# Altium schematic sheet INV.Main.SchDoc
size 1200 x 599 mm; SheetNumber: 3; SheetTotal: 3
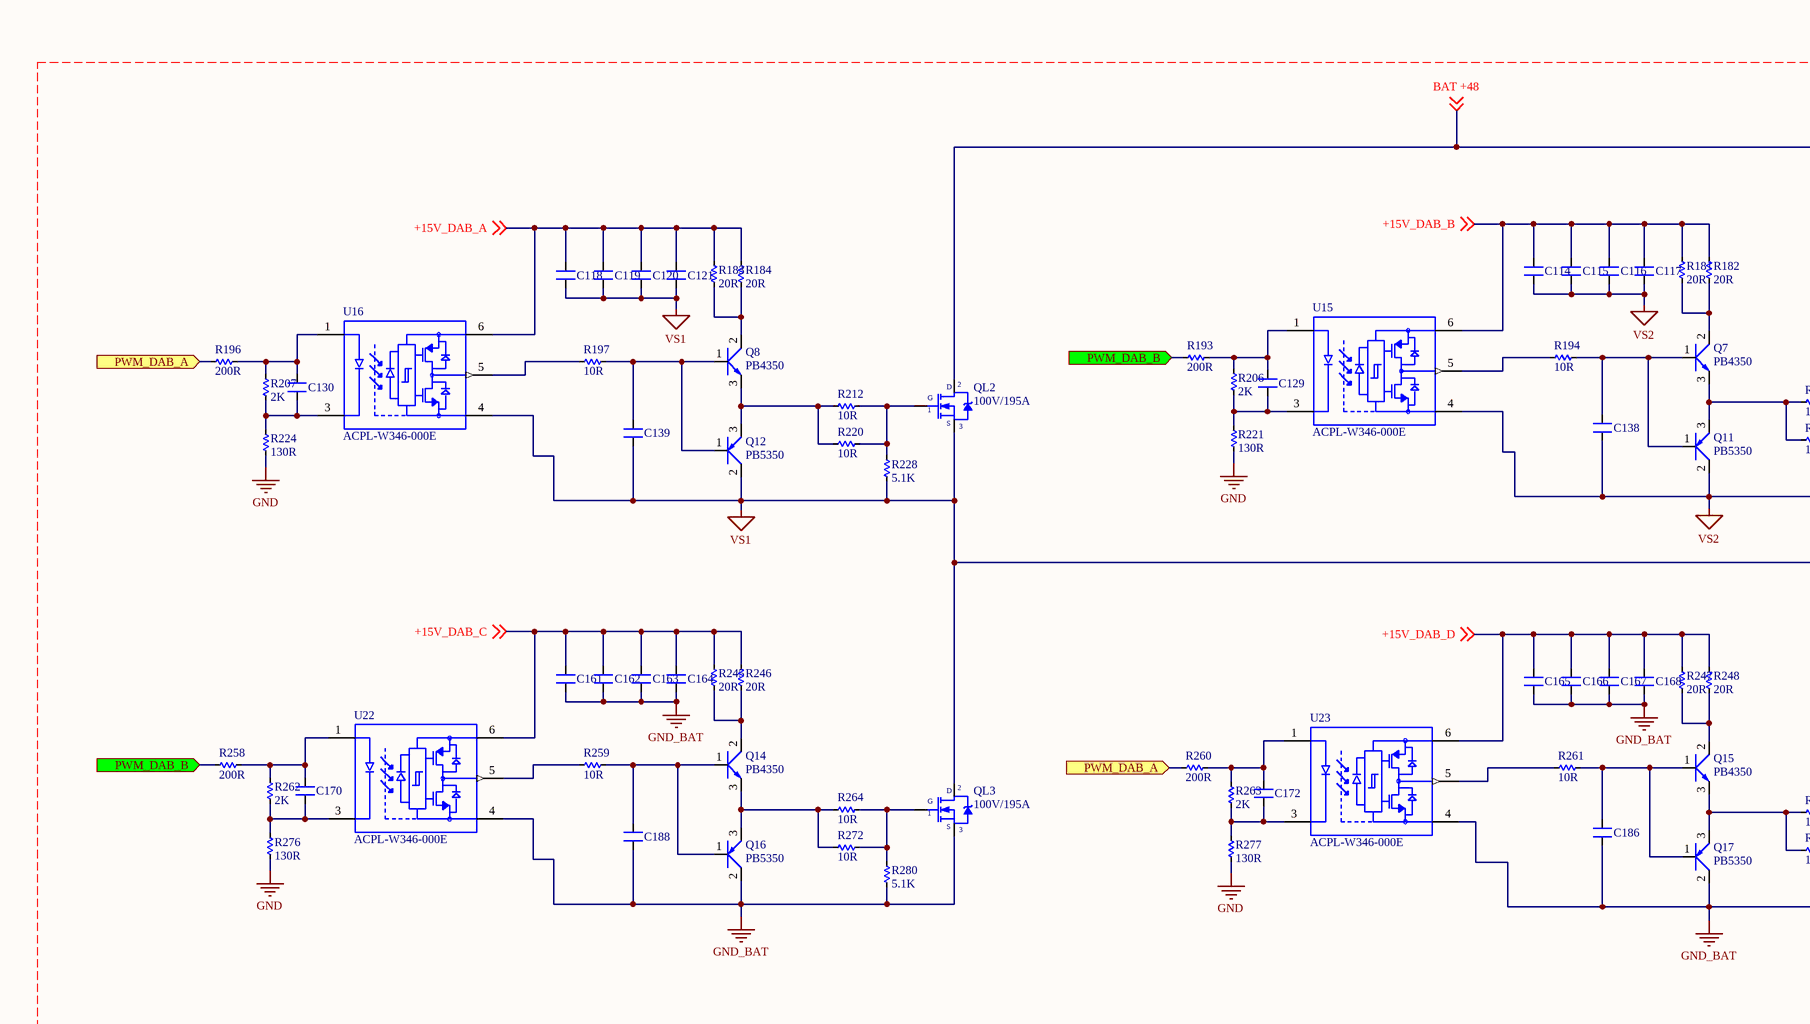
[diagram p0: INV.Main.SchDoc, top left]
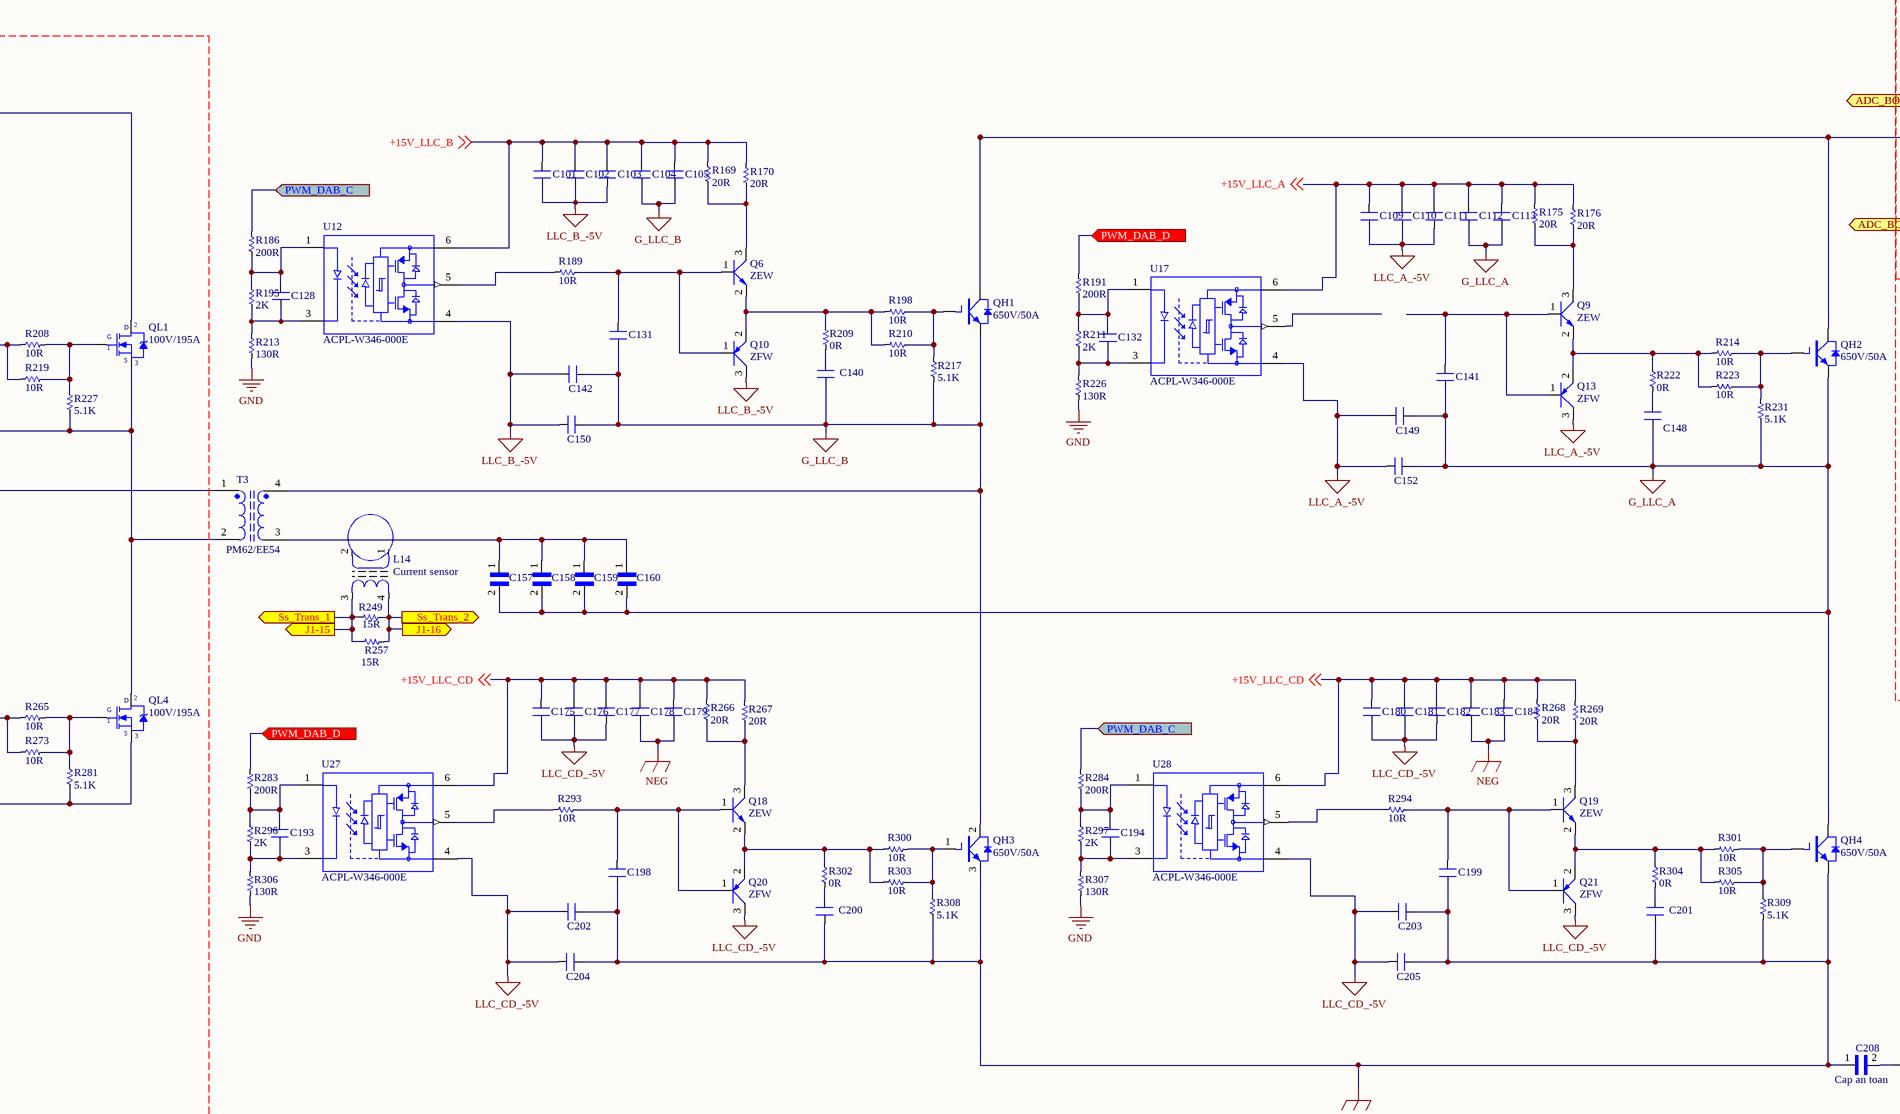
[diagram p1: INV.Main.SchDoc, top middle]
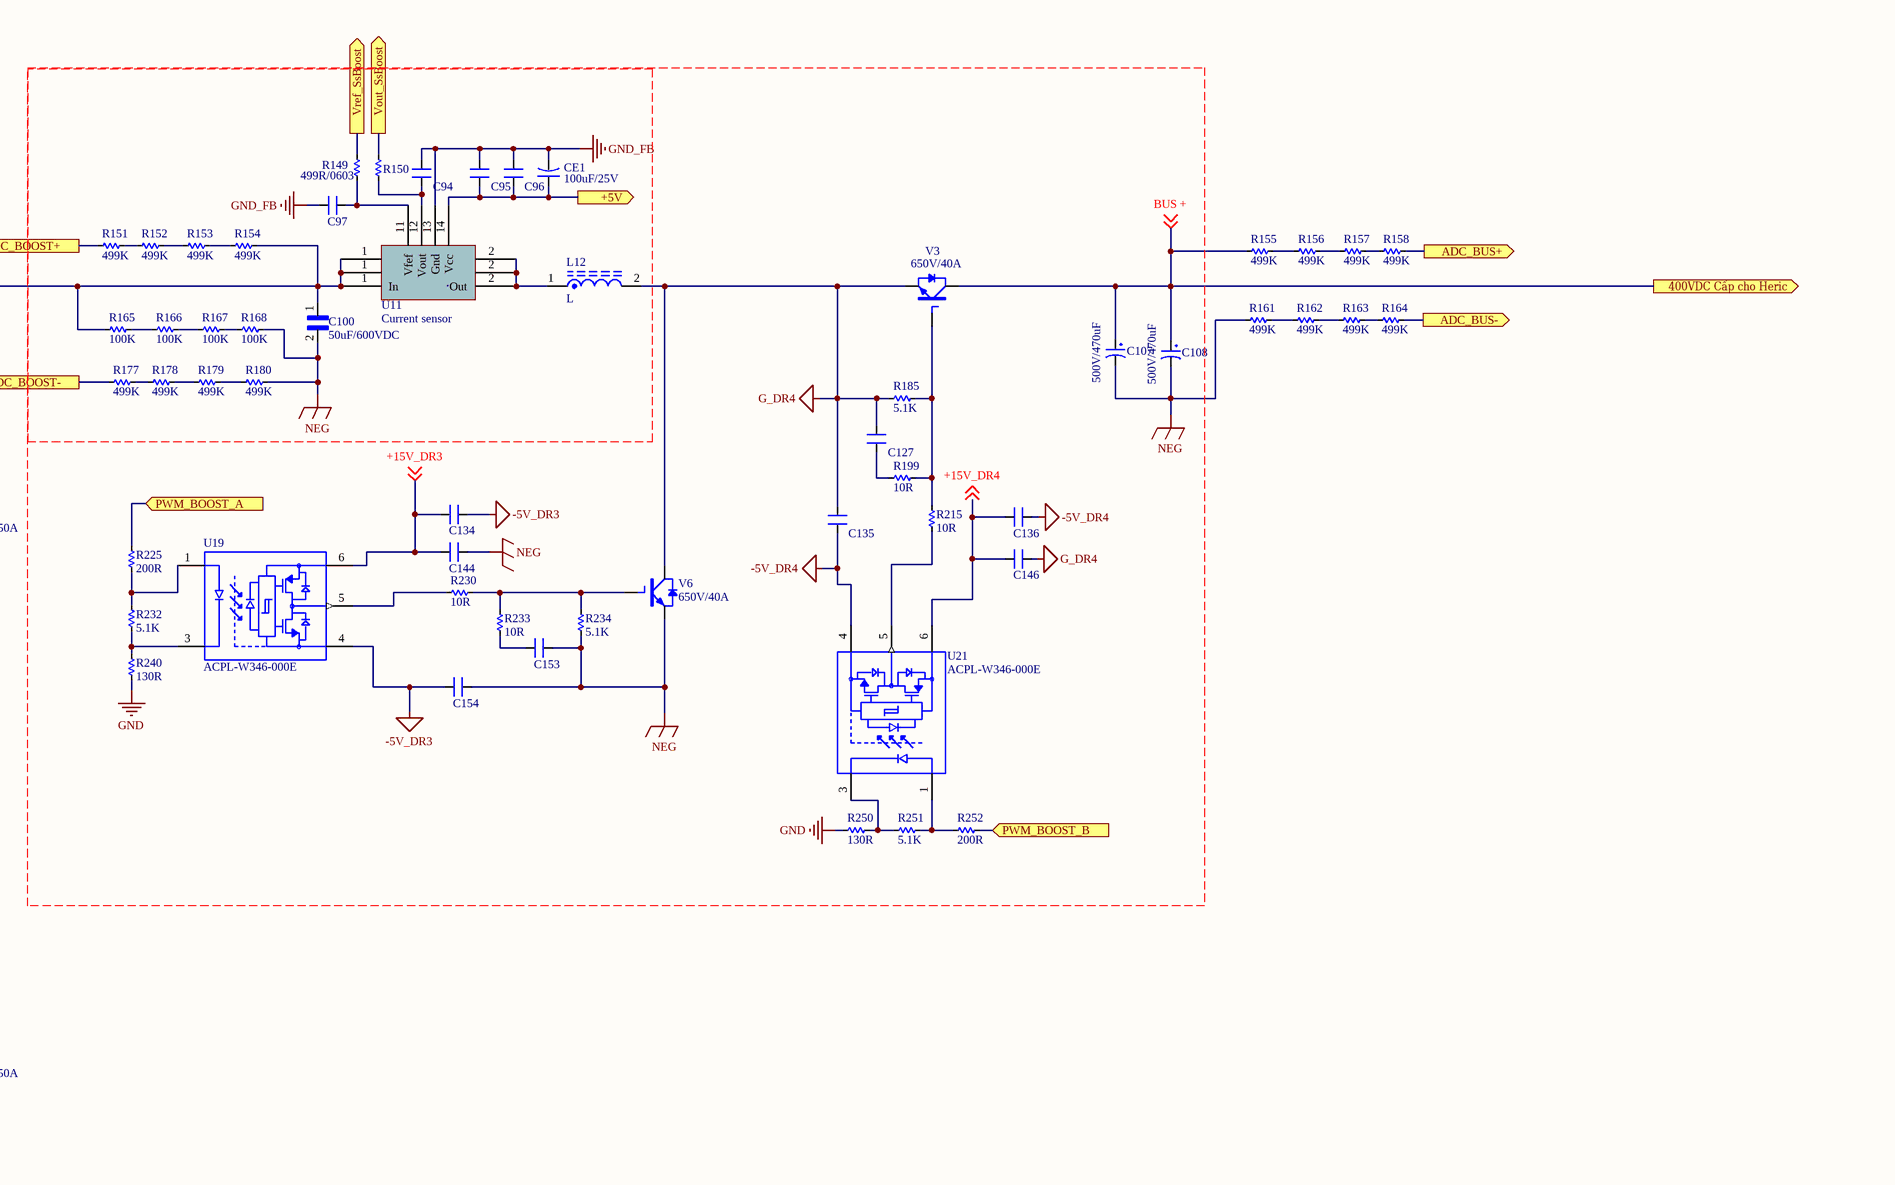
[diagram p2: INV.Main.SchDoc, top right]
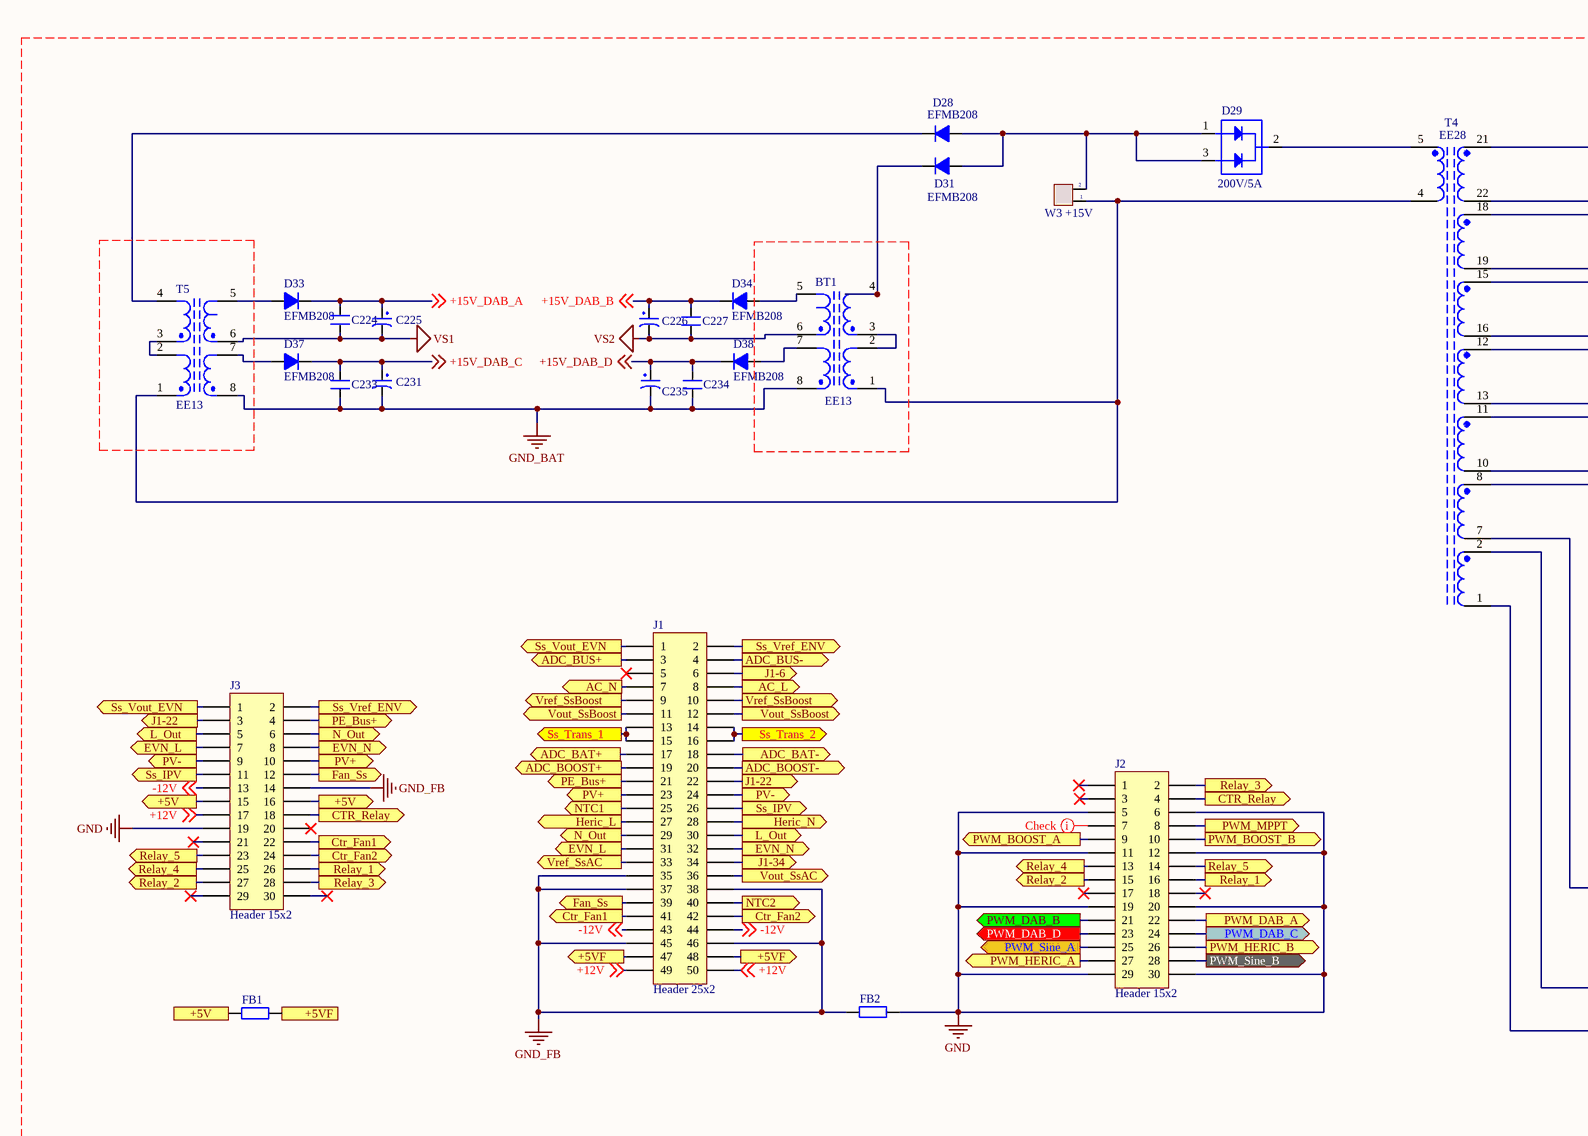
[diagram p3: INV.Main.SchDoc, bottom left]
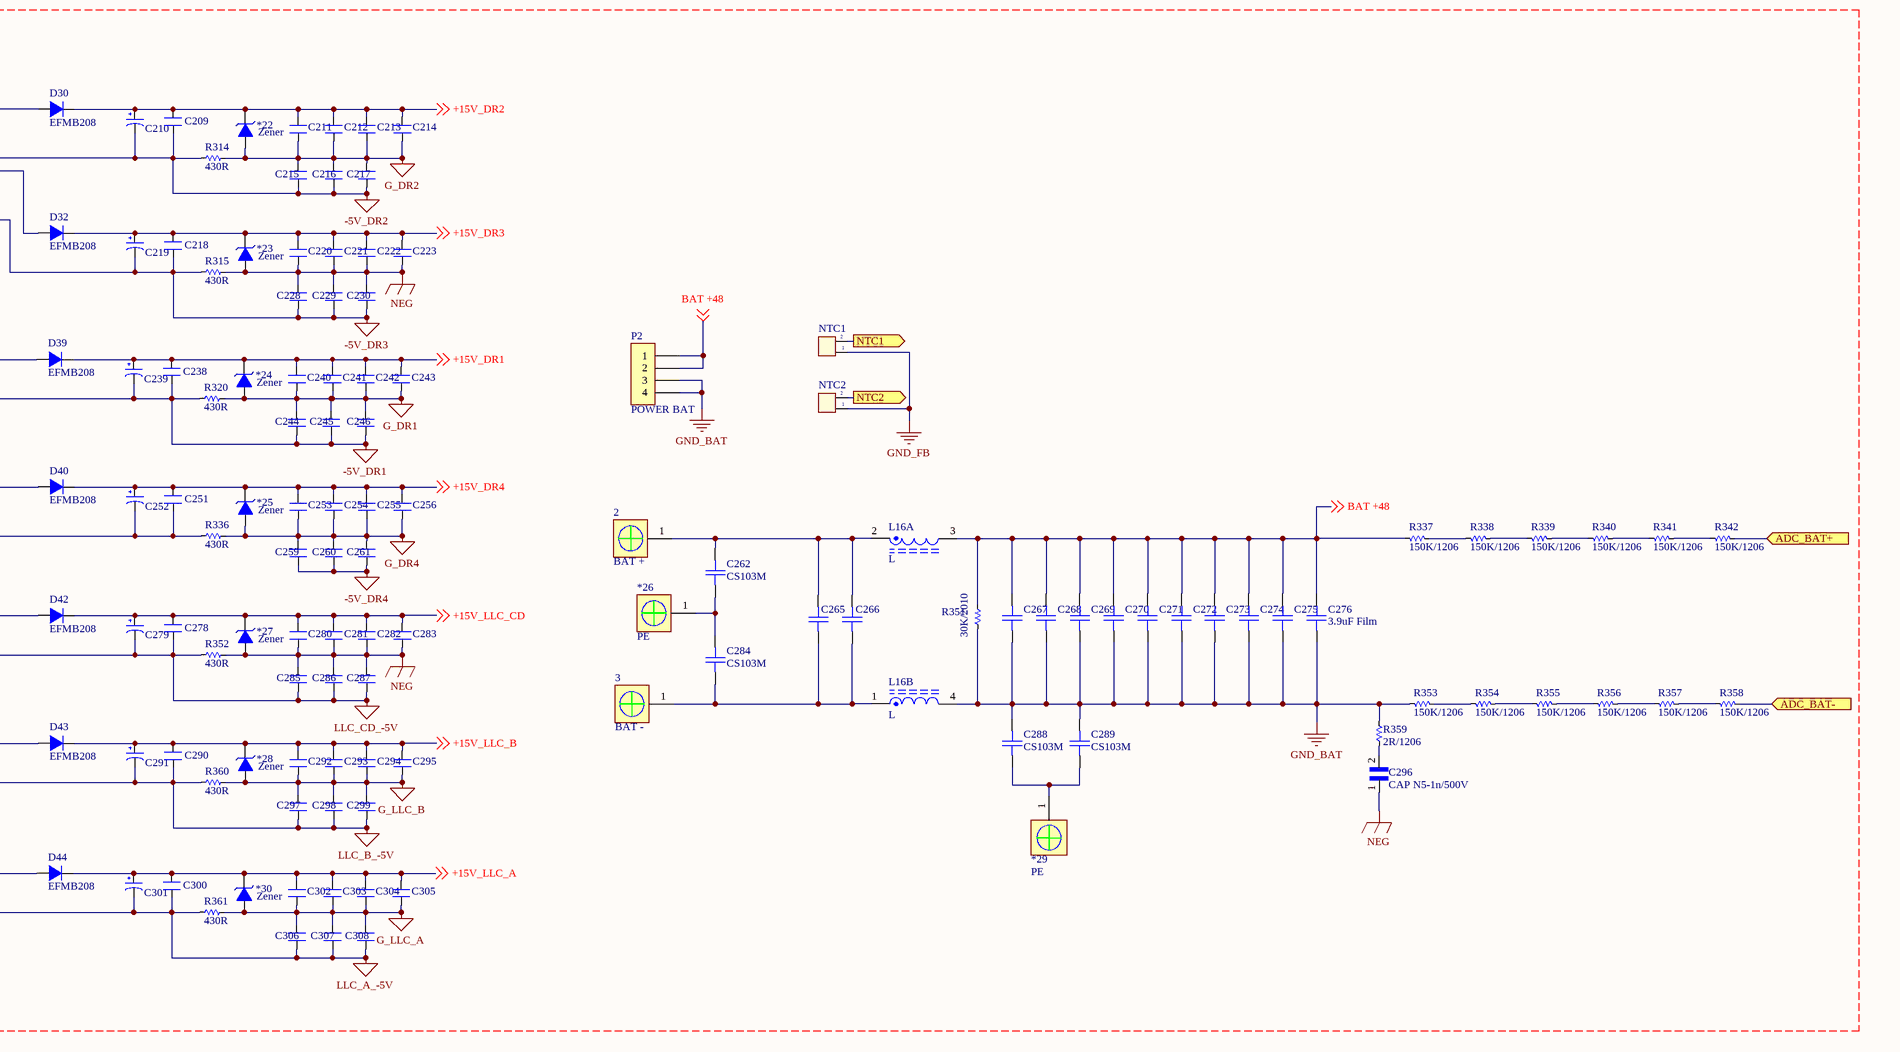
[diagram p4: INV.Main.SchDoc, bottom middle]
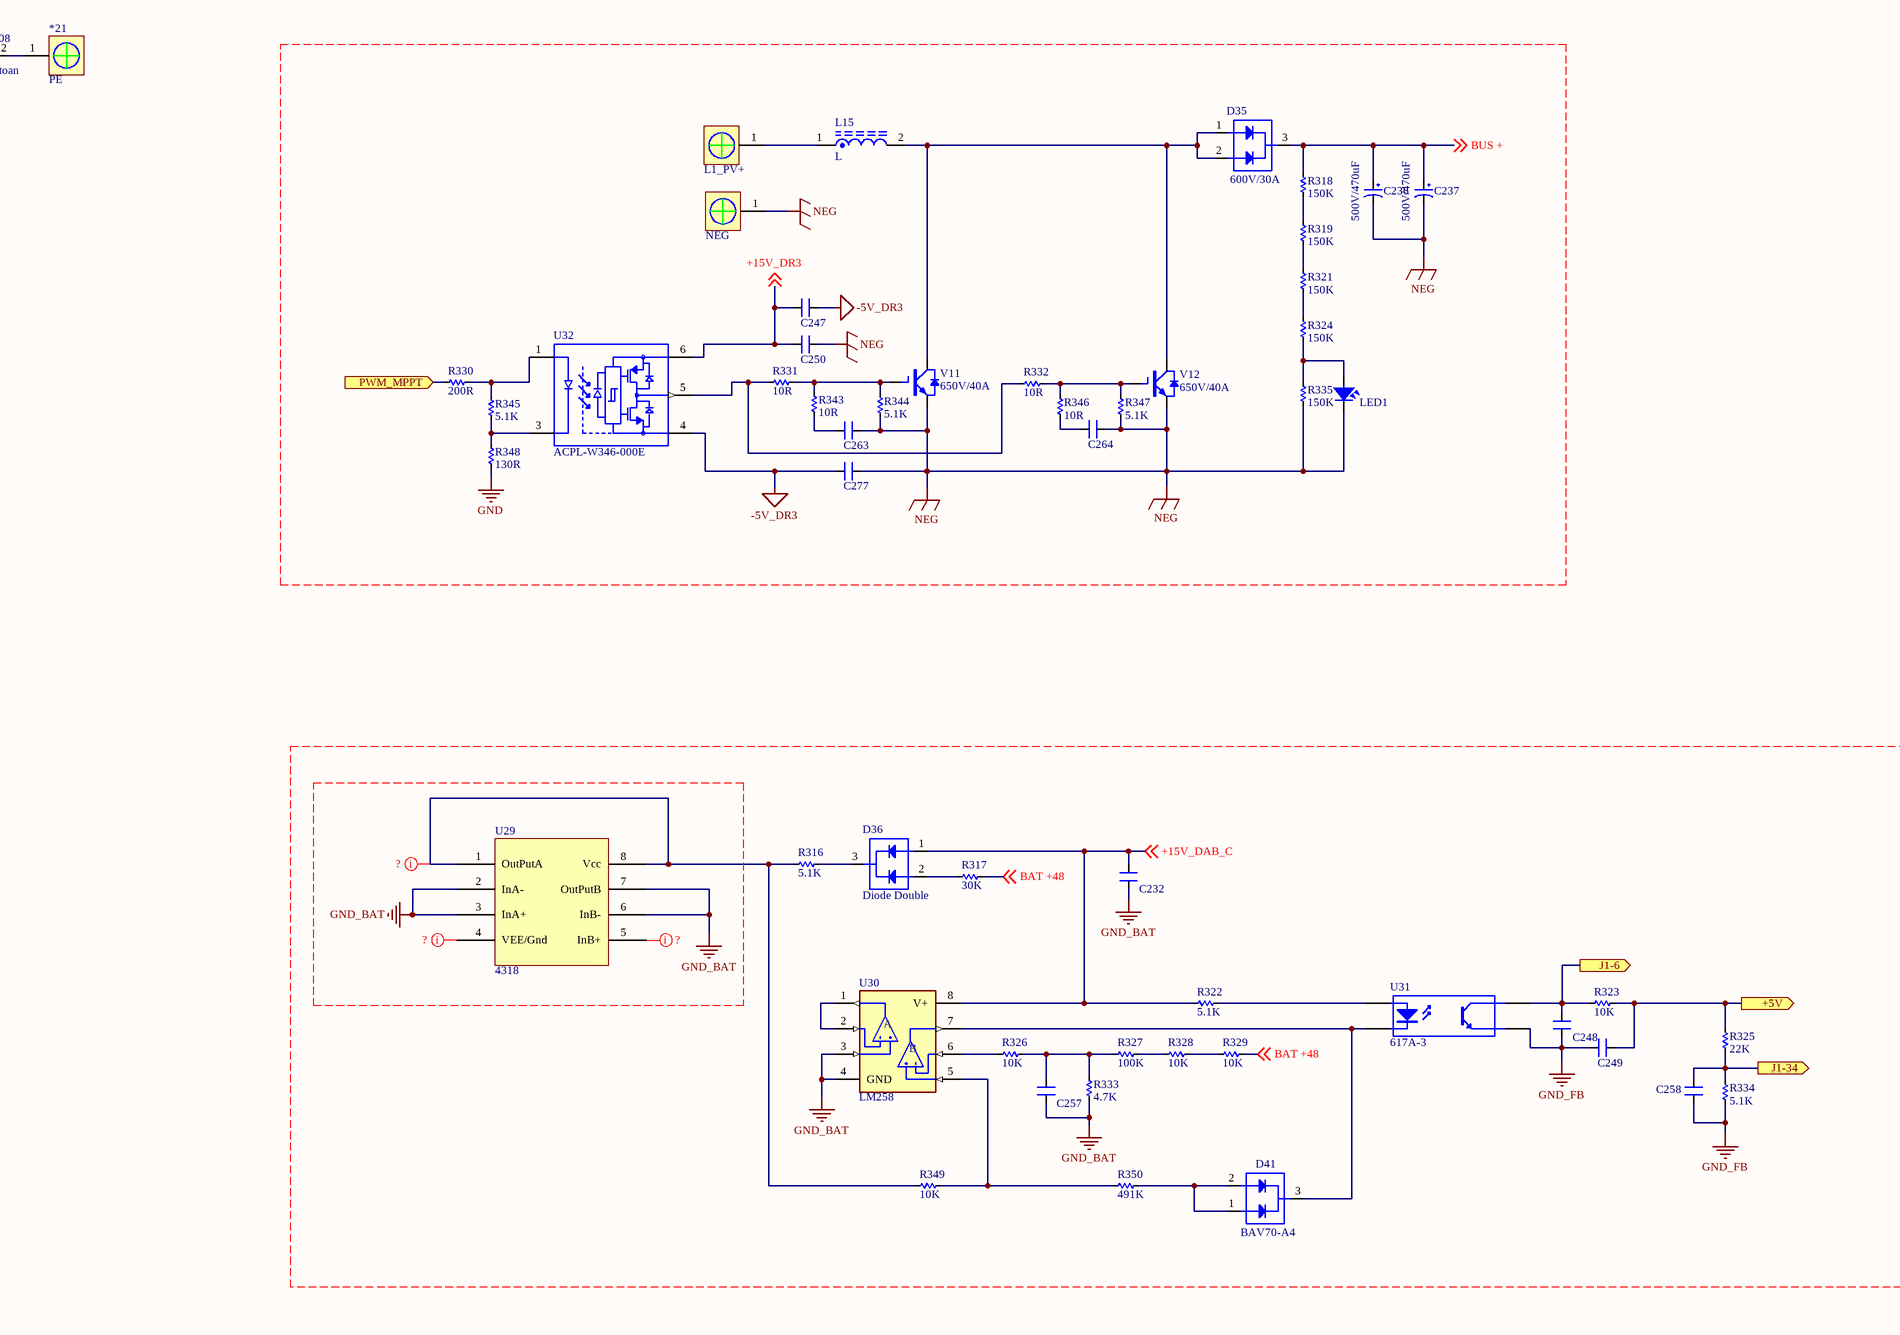
[diagram p5: INV.Main.SchDoc, bottom right]

## Parts
2  BAT +  [Copper Pipe]
3  BAT -  [Copper Pipe]
*21  PE  [Copper Pipe]
*22  Zener  [SMA]
*23  Zener  [SMA]
*24  Zener  [SMA]
*25  Zener  [SMA]
*26  PE  [Copper Pipe]
*27  Zener  [SMA]
*28  Zener  [SMA]
*29  PE  [Copper Pipe]
*30  Zener  [SMA]
BT1  EE13  [Transformer EE13]
C94  0805  [CAP-SMD-0805 EX]  (value not drawn)
C95  0805  [CAP-SMD-0805 EX]  (value not drawn)
C96  0805  [CAP-SMD-0805 EX]  (value not drawn)
C97  0805  [CAP-SMD-0805 EX]  (value not drawn)
C100  50uF/600VDC  [CAP C3D 35x46x35mm]
C101  0805  [CAP-SMD-0805 EX]  (value not drawn)
C102  0805  [CAP-SMD-0805 EX]  (value not drawn)
C103  0805  [CAP-SMD-0805 EX]  (value not drawn)
C104  0805  [CAP-SMD-0805 EX]  (value not drawn)
C105  0805  [CAP-SMD-0805 EX]  (value not drawn)
C107  500V/470uF  [CAP-35x60mm]
C108  500V/470uF  [CAP-35x60mm]
C109  0805  [CAP-SMD-0805 EX]  (value not drawn)
C110  0805  [CAP-SMD-0805 EX]  (value not drawn)
C111  0805  [CAP-SMD-0805 EX]  (value not drawn)
C112  0805  [CAP-SMD-0805 EX]  (value not drawn)
C113  0805  [CAP-SMD-0805 EX]  (value not drawn)
C114  0805  [CAP-SMD-0805 EX]  (value not drawn)
C115  0805  [CAP-SMD-0805 EX]  (value not drawn)
C116  0805  [CAP-SMD-0805 EX]  (value not drawn)
C117  0805  [CAP-SMD-0805 EX]  (value not drawn)
C118  0805  [CAP-SMD-0805 EX]  (value not drawn)
C119  0805  [CAP-SMD-0805 EX]  (value not drawn)
C120  0805  [CAP-SMD-0805 EX]  (value not drawn)
C121  0805  [CAP-SMD-0805 EX]  (value not drawn)
C127  0805  [CAP-SMD-0805 EX]  (value not drawn)
C128  0805  [CAP-SMD-0805 EX]  (value not drawn)
C129  0805  [CAP-SMD-0805 EX]  (value not drawn)
C130  0805  [CAP-SMD-0805 EX]  (value not drawn)
C131  0805  [CAP-SMD-0805 EX]  (value not drawn)
C132  0805  [CAP-SMD-0805 EX]  (value not drawn)
C134  0805  [CAP-SMD-0805 EX]  (value not drawn)
C135  0805  [CAP-SMD-0805 EX]  (value not drawn)
C136  0805  [CAP-SMD-0805 EX]  (value not drawn)
C138  0805  [CAP-SMD-0805 EX]  (value not drawn)
C139  0805  [CAP-SMD-0805 EX]  (value not drawn)
C140  Tu dan gom  [CAP-SMD-0805 EX]  (value not drawn)
C141  0805  [CAP-SMD-0805 EX]  (value not drawn)
C142  0805  [CAP-SMD-0805 EX]  (value not drawn)
C144  0805  [CAP-SMD-0805 EX]  (value not drawn)
C146  0805  [CAP-SMD-0805 EX]  (value not drawn)
C148  0805  [CAP-SMD-0805 EX]  (value not drawn)
C149  0805  [CAP-SMD-0805 EX]  (value not drawn)
C150  0805  [CAP-SMD-0805 EX]  (value not drawn)
C152  0805  [CAP-SMD-0805 EX]  (value not drawn)
C153  0805  [CAP-SMD-0805 EX]  (value not drawn)
C154  0805  [CAP-SMD-0805 EX]  (value not drawn)
C157  CBB 150nF/630V  [CAP MMPK82]  (value not drawn)
C158  CBB 150nF/630V  [CAP MMPK82]  (value not drawn)
C159  CBB 150nF/630V  [CAP MMPK82]  (value not drawn)
C160  CBB 150nF/630V  [CAP MMPK82]  (value not drawn)
C161  0805  [CAP-SMD-0805 EX]  (value not drawn)
C162  0805  [CAP-SMD-0805 EX]  (value not drawn)
C163  0805  [CAP-SMD-0805 EX]  (value not drawn)
C164  0805  [CAP-SMD-0805 EX]  (value not drawn)
C165  0805  [CAP-SMD-0805 EX]  (value not drawn)
C166  0805  [CAP-SMD-0805 EX]  (value not drawn)
C167  0805  [CAP-SMD-0805 EX]  (value not drawn)
C168  0805  [CAP-SMD-0805 EX]  (value not drawn)
C170  0805  [CAP-SMD-0805 EX]  (value not drawn)
C172  0805  [CAP-SMD-0805 EX]  (value not drawn)
C175  0805  [CAP-SMD-0805 EX]  (value not drawn)
C176  0805  [CAP-SMD-0805 EX]  (value not drawn)
C177  0805  [CAP-SMD-0805 EX]  (value not drawn)
C178  0805  [CAP-SMD-0805 EX]  (value not drawn)
C179  0805  [CAP-SMD-0805 EX]  (value not drawn)
C180  0805  [CAP-SMD-0805 EX]  (value not drawn)
C181  0805  [CAP-SMD-0805 EX]  (value not drawn)
C182  0805  [CAP-SMD-0805 EX]  (value not drawn)
C183  0805  [CAP-SMD-0805 EX]  (value not drawn)
C184  0805  [CAP-SMD-0805 EX]  (value not drawn)
C186  0805  [CAP-SMD-0805 EX]  (value not drawn)
C188  0805  [CAP-SMD-0805 EX]  (value not drawn)
C193  0805  [CAP-SMD-0805 EX]  (value not drawn)
C194  0805  [CAP-SMD-0805 EX]  (value not drawn)
C198  0805  [CAP-SMD-0805 EX]  (value not drawn)
C199  0805  [CAP-SMD-0805 EX]  (value not drawn)
C200  Tu dan gom  [CAP-SMD-0805 EX]  (value not drawn)
C201  Tu dan gom  [CAP-SMD-0805 EX]  (value not drawn)
C202  0805  [CAP-SMD-0805 EX]  (value not drawn)
C203  0805  [CAP-SMD-0805 EX]  (value not drawn)
C204  0805  [CAP-SMD-0805 EX]  (value not drawn)
C205  0805  [CAP-SMD-0805 EX]  (value not drawn)
C208  Cap an toan  [Cap an toan]
C209  Tu dan gom  [CAP-SMD-0805 EX]  (value not drawn)
C210  100uF/25V  [CA-6-P2.5]  (value not drawn)
C211  Tu dan gom  [CAP-SMD-0805 EX]  (value not drawn)
C212  Tu dan gom  [CAP-SMD-0805 EX]  (value not drawn)
C213  Tu dan gom  [CAP-SMD-0805 EX]  (value not drawn)
C214  Tu dan gom  [CAP-SMD-0805 EX]  (value not drawn)
C215  Tu dan gom  [CAP-SMD-0805 EX]  (value not drawn)
C216  Tu dan gom  [CAP-SMD-0805 EX]  (value not drawn)
C217  Tu dan gom  [CAP-SMD-0805 EX]  (value not drawn)
C218  Tu dan gom  [CAP-SMD-0805 EX]  (value not drawn)
C219  100uF/25V  [CA-6-P2.5]  (value not drawn)
C220  Tu dan gom  [CAP-SMD-0805 EX]  (value not drawn)
C221  Tu dan gom  [CAP-SMD-0805 EX]  (value not drawn)
C222  Tu dan gom  [CAP-SMD-0805 EX]  (value not drawn)
C223  Tu dan gom  [CAP-SMD-0805 EX]  (value not drawn)
C224  0805  [CAP-SMD-0805 EX]  (value not drawn)
C225  100uF/25V  [CA-6-P2.5]  (value not drawn)
C226  100uF/25V  [CA-6-P2.5]  (value not drawn)
C227  0805  [CAP-SMD-0805 EX]  (value not drawn)
C228  Tu dan gom  [CAP-SMD-0805 EX]  (value not drawn)
C229  Tu dan gom  [CAP-SMD-0805 EX]  (value not drawn)
C230  Tu dan gom  [CAP-SMD-0805 EX]  (value not drawn)
C231  100uF/25V  [CA-6-P2.5]  (value not drawn)
C232  0805  [CAP-SMD-0805 EX]  (value not drawn)
C233  0805  [CAP-SMD-0805 EX]  (value not drawn)
C234  0805  [CAP-SMD-0805 EX]  (value not drawn)
C235  100uF/25V  [CA-6-P2.5]  (value not drawn)
C236  500V/470uF  [CAP-10X17-N]
C237  500V/470uF  [CAP-10X17-N]
C238  Tu dan gom  [CAP-SMD-0805 EX]  (value not drawn)
C239  100uF/25V  [CA-6-P2.5]  (value not drawn)
C240  Tu dan gom  [CAP-SMD-0805 EX]  (value not drawn)
C241  Tu dan gom  [CAP-SMD-0805 EX]  (value not drawn)
C242  Tu dan gom  [CAP-SMD-0805 EX]  (value not drawn)
C243  Tu dan gom  [CAP-SMD-0805 EX]  (value not drawn)
C244  Tu dan gom  [CAP-SMD-0805 EX]  (value not drawn)
C245  Tu dan gom  [CAP-SMD-0805 EX]  (value not drawn)
C246  Tu dan gom  [CAP-SMD-0805 EX]  (value not drawn)
C247  0805  [CAP-SMD-0805 EX]  (value not drawn)
C248  0805  [CAP-SMD-0805 EX]  (value not drawn)
C249  0805  [CAP-SMD-0805 EX]  (value not drawn)
C250  0805  [CAP-SMD-0805 EX]  (value not drawn)
C251  Tu dan gom  [CAP-SMD-0805 EX]  (value not drawn)
C252  100uF/25V  [CA-6-P2.5]  (value not drawn)
C253  Tu dan gom  [CAP-SMD-0805 EX]  (value not drawn)
C254  Tu dan gom  [CAP-SMD-0805 EX]  (value not drawn)
C255  Tu dan gom  [CAP-SMD-0805 EX]  (value not drawn)
C256  Tu dan gom  [CAP-SMD-0805 EX]  (value not drawn)
C257  0805  [CAP-SMD-0805 EX]  (value not drawn)
C258  0805  [CAP-SMD-0805 EX]  (value not drawn)
C259  Tu dan gom  [CAP-SMD-0805 EX]  (value not drawn)
C260  Tu dan gom  [CAP-SMD-0805 EX]  (value not drawn)
C261  Tu dan gom  [CAP-SMD-0805 EX]  (value not drawn)
C262  CS103M  [Cap an toan CS103M]
C263  0805  [CAP-SMD-0805 EX]  (value not drawn)
C264  0805  [CAP-SMD-0805 EX]  (value not drawn)
C265  (no value)  [CAP-SMD-1206 EX]
C266  (no value)  [CAP-SMD-1206 EX]
C267  3.9uF Film  [Cap Film CL21]  (value not drawn)
C268  395K  [Cap Film CL21]  (value not drawn)
C269  395K  [Cap Film CL21]  (value not drawn)
C270  395K  [Cap Film CL21]  (value not drawn)
C271  395K  [Cap Film CL21]  (value not drawn)
C272  395K  [Cap Film CL21]  (value not drawn)
C273  395K  [Cap Film CL21]  (value not drawn)
C274  395K  [Cap Film CL21]  (value not drawn)
C275  395K  [Cap Film CL21]  (value not drawn)
C276  3.9uF Film  [Cap Film CL21]
C277  0805  [CAP-SMD-0805 EX]  (value not drawn)
C278  Tu dan gom  [CAP-SMD-0805 EX]  (value not drawn)
C279  100uF/25V  [CA-6-P2.5]  (value not drawn)
C280  Tu dan gom  [CAP-SMD-0805 EX]  (value not drawn)
C281  Tu dan gom  [CAP-SMD-0805 EX]  (value not drawn)
C282  Tu dan gom  [CAP-SMD-0805 EX]  (value not drawn)
C283  Tu dan gom  [CAP-SMD-0805 EX]  (value not drawn)
C284  CS103M  [Cap an toan CS103M]
C285  Tu dan gom  [CAP-SMD-0805 EX]  (value not drawn)
C286  Tu dan gom  [CAP-SMD-0805 EX]  (value not drawn)
C287  Tu dan gom  [CAP-SMD-0805 EX]  (value not drawn)
C288  CS103M  [Cap an toan CS103M]
C289  CS103M  [Cap an toan CS103M]
C290  Tu dan gom  [CAP-SMD-0805 EX]  (value not drawn)
C291  100uF/25V  [CA-6-P2.5]  (value not drawn)
C292  Tu dan gom  [CAP-SMD-0805 EX]  (value not drawn)
C293  Tu dan gom  [CAP-SMD-0805 EX]  (value not drawn)
C294  Tu dan gom  [CAP-SMD-0805 EX]  (value not drawn)
C295  Tu dan gom  [CAP-SMD-0805 EX]  (value not drawn)
C296  CAP N5-1n/500V  [CAP 1nF/500VAC, Y1]
C297  Tu dan gom  [CAP-SMD-0805 EX]  (value not drawn)
C298  Tu dan gom  [CAP-SMD-0805 EX]  (value not drawn)
C299  Tu dan gom  [CAP-SMD-0805 EX]  (value not drawn)
C300  Tu dan gom  [CAP-SMD-0805 EX]  (value not drawn)
C301  100uF/25V  [CA-6-P2.5]  (value not drawn)
C302  Tu dan gom  [CAP-SMD-0805 EX]  (value not drawn)
C303  Tu dan gom  [CAP-SMD-0805 EX]  (value not drawn)
C304  Tu dan gom  [CAP-SMD-0805 EX]  (value not drawn)
C305  Tu dan gom  [CAP-SMD-0805 EX]  (value not drawn)
C306  Tu dan gom  [CAP-SMD-0805 EX]  (value not drawn)
C307  Tu dan gom  [CAP-SMD-0805 EX]  (value not drawn)
C308  Tu dan gom  [CAP-SMD-0805 EX]  (value not drawn)
CE1  100uF/25V  [CA-6-P2.5]
D28  EFMB208  [SMB]
D29  200V/5A  [TO252-123]
D30  EFMB208  [SMB]
D31  EFMB208  [SMB]
D32  EFMB208  [SMB]
D33  EFMB208  [SMB]
D34  EFMB208  [SMB]
D35  600V/30A  [TO-247-Diode]
D36  Diode Double  [SOT-23]
D37  EFMB208  [SMB]
D38  EFMB208  [SMB]
D39  EFMB208  [SMB]
D40  EFMB208  [SMB]
D41  BAV70-A4  [SOT-23]
D42  EFMB208  [SMB]
D43  EFMB208  [SMB]
D44  EFMB208  [SMB]
FB1  (no value)  [RES-SMD-1206 EX]
FB2  (no value)  [RES-SMD-1206 EX]
J1  Header 25x2  [Header 2x50]
J2  Header 15x2  [Header 2x15]
J3  Header 15x2  [Head 1X16 - CAI THANG]
J6  W3 +15V  [Header2]
L12  L  [LBOSHOG-V1]
L14  Current sensor  [Bien ap do Current]
L15  L  [LBOSPVOG-V1]
L16  L  [LBATOG-V1]  (parts A,B of 2)
LED1  LED  [LED-0805-Red]  (value not drawn)
NTC1  Temp Sensor  [JP 1x2 CT]  (value not drawn)
NTC2  Temp Sensor  [JP 1x2 CT]  (value not drawn)
P2  POWER BAT  [XH2.54M-4]
PV_+3  L1_PV+  [Copper Pipe]
PV_+4  NEG  [Copper Pipe]
Q6  ZEW  [SOT-23]
Q7  PB4350  [SOT223]
Q8  PB4350  [SOT223]
Q9  ZEW  [SOT-23]
Q10  ZFW  [SOT-23]
Q11  PB5350  [SOT223]
Q12  PB5350  [SOT223]
Q13  ZFW  [SOT-23]
Q14  PB4350  [SOT223]
Q15  PB4350  [SOT223]
Q16  PB5350  [SOT223]
Q17  PB5350  [SOT223]
Q18  ZEW  [SOT-23]
Q19  ZEW  [SOT-23]
Q20  ZFW  [SOT-23]
Q21  ZFW  [SOT-23]
QH1  650V/50A  [TO-247_1]
QH2  650V/50A  [TO-247_1]
QH3  650V/50A  [TO-247_1]
QH4  650V/50A  [TO-247_1]
QL1  100V/195A  [TO-247]
QL2  100V/195A  [TO-247]
QL3  100V/195A  [TO-247]
QL4  100V/195A  [TO-247]
R149  499R/0603  [RES-SMD-1206 EX]
R150  499R/0603  [RES-SMD-1206 EX]  (value not drawn)
R151  499K  [RES-SMD-1206 EX]
R152  499K  [RES-SMD-1206 EX]
R153  499K  [RES-SMD-1206 EX]
R154  499K  [RES-SMD-1206 EX]
R155  499K  [RES-SMD-1206 EX]
R156  499K  [RES-SMD-1206 EX]
R157  499K  [RES-SMD-1206 EX]
R158  499K  [RES-SMD-1206 EX]
R161  499K  [RES-SMD-1206 EX]
R162  499K  [RES-SMD-1206 EX]
R163  499K  [RES-SMD-1206 EX]
R164  499K  [RES-SMD-1206 EX]
R165  100K  [RES-SMD-1206 EX]
R166  100K  [RES-SMD-1206 EX]
R167  100K  [RES-SMD-1206 EX]
R168  100K  [RES-SMD-1206 EX]
R169  20R  [RES-SMD-0805 EX]
R170  20R  [RES-SMD-0805 EX]
R175  20R  [RES-SMD-0805 EX]
R176  20R  [RES-SMD-0805 EX]
R177  499K  [RES-SMD-1206 EX]
R178  499K  [RES-SMD-1206 EX]
R179  499K  [RES-SMD-1206 EX]
R180  499K  [RES-SMD-1206 EX]
R181  20R  [RES-SMD-0805 EX]
R182  20R  [RES-SMD-0805 EX]
R183  20R  [RES-SMD-0805 EX]
R184  20R  [RES-SMD-0805 EX]
R185  5.1K  [RES-SMD-0805 EX]
R186  200R  [RES-SMD-0805 EX]
R189  10R  [RES-SMD-0805 EX]
R191  200R  [RES-SMD-0805 EX]
R193  200R  [RES-SMD-0805 EX]
R194  10R  [RES-SMD-0805 EX]
R195  2K  [RES-SMD-0805 EX]
R196  200R  [RES-SMD-0805 EX]
R197  10R  [RES-SMD-0805 EX]
R198  10R  [RES-SMD-0805 EX]
R199  10R  [RES-SMD-0805 EX]
R206  2K  [RES-SMD-0805 EX]
R207  2K  [RES-SMD-0805 EX]
R208  10R  [RES-SMD-0805 EX]
R209  0R  [RES-SMD-0805 EX]
R210  10R  [RES-SMD-0805 EX]
R211  2K  [RES-SMD-0805 EX]
R212  10R  [RES-SMD-0805 EX]
R213  130R  [RES-SMD-0805 EX]
R214  10R  [RES-SMD-0805 EX]
R215  10R  [RES-SMD-0805 EX]
R217  5.1K  [RES-SMD-0805 EX]
R219  10R  [RES-SMD-0805 EX]
R220  10R  [RES-SMD-0805 EX]
R221  130R  [RES-SMD-0805 EX]
R222  0R  [RES-SMD-0805 EX]
R223  10R  [RES-SMD-0805 EX]
R224  130R  [RES-SMD-0805 EX]
R225  200R  [RES-SMD-0805 EX]
R226  130R  [RES-SMD-0805 EX]
R227  5.1K  [RES-SMD-0805 EX]
R228  5.1K  [RES-SMD-0805 EX]
R230  10R  [RES-SMD-0805 EX]
R231  5.1K  [RES-SMD-0805 EX]
R232  5.1K  [RES-SMD-0805 EX]
R233  10R  [RES-SMD-0805 EX]
R234  5.1K  [RES-SMD-0805 EX]
R240  130R  [RES-SMD-0805 EX]
R245  20R  [RES-SMD-0805 EX]
R246  20R  [RES-SMD-0805 EX]
R247  20R  [RES-SMD-0805 EX]
R248  20R  [RES-SMD-0805 EX]
R249  15R  [R1206]
R250  130R  [RES-SMD-0805 EX]
R251  5.1K  [RES-SMD-0805 EX]
R252  200R  [RES-SMD-0805 EX]
R257  15R  [R1206]
R258  200R  [RES-SMD-0805 EX]
R259  10R  [RES-SMD-0805 EX]
R260  200R  [RES-SMD-0805 EX]
R261  10R  [RES-SMD-0805 EX]
R262  2K  [RES-SMD-0805 EX]
R263  2K  [RES-SMD-0805 EX]
R264  10R  [RES-SMD-0805 EX]
R265  10R  [RES-SMD-0805 EX]
R266  20R  [RES-SMD-0805 EX]
R267  20R  [RES-SMD-0805 EX]
R268  20R  [RES-SMD-0805 EX]
R269  20R  [RES-SMD-0805 EX]
R272  10R  [RES-SMD-0805 EX]
R273  10R  [RES-SMD-0805 EX]
R276  130R  [RES-SMD-0805 EX]
R277  130R  [RES-SMD-0805 EX]
R280  5.1K  [RES-SMD-0805 EX]
R281  5.1K  [RES-SMD-0805 EX]
R283  200R  [RES-SMD-0805 EX]
R284  200R  [RES-SMD-0805 EX]
R293  10R  [RES-SMD-0805 EX]
R294  10R  [RES-SMD-0805 EX]
R296  2K  [RES-SMD-0805 EX]
R297  2K  [RES-SMD-0805 EX]
R300  10R  [RES-SMD-0805 EX]
R301  10R  [RES-SMD-0805 EX]
R302  0R  [RES-SMD-0805 EX]
R303  10R  [RES-SMD-0805 EX]
R304  0R  [RES-SMD-0805 EX]
R305  10R  [RES-SMD-0805 EX]
R306  130R  [RES-SMD-0805 EX]
R307  130R  [RES-SMD-0805 EX]
R308  5.1K  [RES-SMD-0805 EX]
R309  5.1K  [RES-SMD-0805 EX]
R314  430R  [R1206]
R315  430R  [R1206]
R316  5.1K  [RES-SMD-0805 EX]
R317  30K  [RES-SMD-1210 EX]
R318  150K  [RES-SMD-1210 EX]
R319  150K  [RES-SMD-1210 EX]
R320  430R  [R1206]
R321  150K  [RES-SMD-1210 EX]
R322  5.1K  [RES-SMD-0805 EX]
R323  10K  [RES-SMD-0805 EX]
R324  150K  [RES-SMD-1210 EX]
R325  22K  [RES-SMD-0805 EX]
R326  10K  [RES-SMD-0805 EX]
R327  100K  [RES-SMD-1206 EX]
R328  10K  [RES-SMD-0805 EX]
R329  10K  [RES-SMD-0805 EX]
R330  200R  [RES-SMD-0805 EX]
R331  10R  [RES-SMD-0805 EX]
R332  10R  [RES-SMD-0805 EX]
R333  4.7K  [RES-SMD-0805 EX]
R334  5.1K  [RES-SMD-0805 EX]
R335  150K  [RES-SMD-1210 EX]
R336  430R  [R1206]
R337  150K/1206  [RES-SMD-1206 EX]
R338  150K/1206  [RES-SMD-1206 EX]
R339  150K/1206  [RES-SMD-1206 EX]
R340  150K/1206  [RES-SMD-1206 EX]
R341  150K/1206  [RES-SMD-1206 EX]
R342  150K/1206  [RES-SMD-1206 EX]
R343  10R  [RES-SMD-0805 EX]
R344  5.1K  [RES-SMD-0805 EX]
R345  5.1K  [RES-SMD-0805 EX]
R346  10R  [RES-SMD-0805 EX]
R347  5.1K  [RES-SMD-0805 EX]
R348  130R  [RES-SMD-0805 EX]
R349  10K  [RES-SMD-0805 EX]
R350  491K  [RES-SMD-0805 EX]
R351  30K/2010  [RES-SMD-1210 EX]
R352  430R  [R1206]
R353  150K/1206  [RES-SMD-1206 EX]
R354  150K/1206  [RES-SMD-1206 EX]
R355  150K/1206  [RES-SMD-1206 EX]
R356  150K/1206  [RES-SMD-1206 EX]
R357  150K/1206  [RES-SMD-1206 EX]
R358  150K/1206  [RES-SMD-1206 EX]
R359  2R/1206  [RES-SMD-1206 EX]
R360  430R  [R1206]
R361  430R  [R1206]
T3  PM62/EE54  [Transfomer 600W]
T4  EE28  [Transformer EE28]
T5  EE13  [BAX_DVD3]
U11  Current sensor  [Current sensor STB-CAS]
U12  ACPL-W346-000E  [SOIC127P1150X360-6N]
U15  ACPL-W346-000E  [SOIC127P1150X360-6N]
U16  ACPL-W346-000E  [SOIC127P1150X360-6N]
U17  ACPL-W346-000E  [SOIC127P1150X360-6N]
U19  ACPL-W346-000E  [SOIC127P1150X360-6N]
U21  ACPL-W346-000E  [SOIC127P1150X360-6N]
U22  ACPL-W346-000E  [SOIC127P1150X360-6N]
U23  ACPL-W346-000E  [SOIC127P1150X360-6N]
U27  ACPL-W346-000E  [SOIC127P1150X360-6N]
U28  ACPL-W346-000E  [SOIC127P1150X360-6N]
U29  4318  [SOP 8]
U30  LM258  [SOIC127P600X175-8N]
U31  617A-3  [OPTO TRANSISTOR_SOP-4]
U32  ACPL-W346-000E  [SOIC127P1150X360-6N]
V3  650V/40A  [TO-247_1]
V6  650V/40A  [TO-247_1]
V11  650V/40A  [TO-3P]
V12  650V/40A  [TO-247_1]

## Ports
400VDC Cấp cho Heric (out, see INV.ControlMCU[1D], INV.ControlMCU[5C], INV.Main[1D]), +5V (out, see INV.Main[1D], INV.Main[3A], INV.Main[3D], INV.Main[4A], INV.Power[1D], INV.Power[6C]), +5V (out, see INV.Main[1D], INV.Main[3A], INV.Main[4A], INV.Power[1D], INV.Power[6C]), +5V (out, see INV.Main[1D], INV.Main[3D], INV.Main[4A], INV.Power[1D], INV.Power[6C]), +5VF (out, see INV.ControlMCU[1D], INV.Main[1D]), AC_L (out, see INV.ControlMCU[1D], INV.ControlMCU[4D], INV.Main[4B]), AC_N (out, see INV.ControlMCU[1D], INV.ControlMCU[4D], INV.Main[4B]), ADC_BAT+ (in, see INV.ControlMCU[1D], INV.ControlMCU[5C], INV.Main[1D]), ADC_BAT+ (out, see INV.ControlMCU[1D], INV.ControlMCU[5C], INV.Main[2D]), ADC_BAT- (in, see INV.ControlMCU[1D], INV.ControlMCU[5C], INV.Main[1D]), ADC_BAT- (out, see INV.ControlMCU[1D], INV.ControlMCU[5C], INV.Main[2D]), ADC_BOOST+ (out, see INV.ControlMCU[1D], INV.ControlMCU[5C], INV.Main[1D]), ADC_BOOST+ (out, see INV.ControlMCU[1D], INV.ControlMCU[5C], INV.Main[2A]), ADC_BOOST- (out, see INV.ControlMCU[1D], INV.ControlMCU[5C], INV.Main[1D]), ADC_BOOST- (out, see INV.ControlMCU[1D], INV.ControlMCU[5C], INV.Main[2B]), ADC_BUS+ (out, see INV.ControlMCU[1D], INV.ControlMCU[5C], INV.Main[1D]), ADC_BUS+ (out, see INV.ControlMCU[1D], INV.ControlMCU[5C], INV.Main[3A]), ADC_BUS- (out, see INV.ControlMCU[1D], INV.ControlMCU[5C], INV.Main[1D]), ADC_BUS- (out, see INV.ControlMCU[1D], INV.ControlMCU[5C], INV.Main[3A]), Ctr_Fan1 (out, see INV.ControlMCU[1D], INV.Main[1D], INV.Power[1C], INV.Power[1D]), Ctr_Fan2 (out, see INV.ControlMCU[1D], INV.ControlMCU[2C], INV.Main[1D], INV.Power[1C], INV.Power[1D]), CTR_Relay (out, see INV.ControlMCU[1D], INV.ControlMCU[2C], INV.Main[1D], INV.Power[1D], INV.Power[4A]), EVN_L (out, see INV.ControlMCU[1D], INV.Main[1D], INV.Power[1A], INV.Power[1D]), EVN_N (out, see INV.ControlMCU[1D], INV.Main[1D], INV.Power[1A], INV.Power[1D]), Fan_Ss (out, see INV.ControlMCU[1D], INV.ControlMCU[2C], INV.Main[1D], INV.Power[1C], INV.Power[1D]), Heric_L (out, see INV.ControlMCU[1D], INV.ControlMCU[5D], INV.Main[4B]), Heric_N (out, see INV.ControlMCU[1D], INV.ControlMCU[5D], INV.Main[4C]), J1-6 (out, see INV.ControlMCU[1D], INV.Main[1D]), J1-6 (out, see INV.ControlMCU[1D], INV.Main[3C]), J1-15 (out), J1-16 (out), J1-22 (out, see INV.ControlMCU[1D], INV.Main[1D]), J1-34 (out, see INV.ControlMCU[1D], INV.Main[1D]), J1-34 (out, see INV.ControlMCU[1D], INV.Main[3D]), L_Out (out, see INV.ControlMCU[1D], INV.Main[1D], INV.Power[1D], INV.Power[3A]), N_Out (out, see INV.ControlMCU[1D], INV.Main[1D], INV.Power[1D], INV.Power[3A]), NTC1 (out, see INV.ControlMCU[1D], INV.Main[1D]), NTC1 (out, see INV.ControlMCU[1D], INV.Main[2C]), NTC2 (out, see INV.ControlMCU[1D], INV.Main[1D]), NTC2 (out, see INV.ControlMCU[1D], INV.Main[2C]), PE_Bus+ (out, see INV.ControlMCU[1D], INV.Main[1D], INV.Power[1D], INV.Power[5B]), PV+ (out, see INV.ControlMCU[1D], INV.Main[1D], INV.Power[1D], INV.Power[2D]), PV- (out, see INV.ControlMCU[1D], INV.Main[1D], INV.Power[1D], INV.Power[2D]), PWM_BOOST_A (in, see INV.ControlMCU[1D], INV.ControlMCU[2D], INV.Main[1D]), PWM_BOOST_A (out, see INV.ControlMCU[1D], INV.ControlMCU[2D], INV.Main[2B]), PWM_BOOST_B (in, see INV.ControlMCU[1D], INV.ControlMCU[2D], INV.Main[1D]), PWM_BOOST_B (out, see INV.ControlMCU[1D], INV.ControlMCU[2D], INV.Main[3B]), PWM_DAB_A (in, see INV.ControlMCU[1D], INV.ControlMCU[3D], INV.Main[1B], INV.Main[1D]), PWM_DAB_A (out, see INV.ControlMCU[1D], INV.ControlMCU[3D], INV.Main[1B]), PWM_DAB_B (in, see INV.ControlMCU[1D], INV.ControlMCU[3D], INV.Main[1B], INV.Main[1D]), PWM_DAB_B (out, see INV.ControlMCU[1D], INV.ControlMCU[3D], INV.Main[1B]), PWM_DAB_C (in, see INV.ControlMCU[1D], INV.ControlMCU[3D], INV.Main[1D], INV.Main[2B]), PWM_DAB_C (out, see INV.ControlMCU[1D], INV.ControlMCU[3D], INV.Main[2B]), PWM_DAB_D (in, see INV.ControlMCU[1D], INV.ControlMCU[3D], INV.Main[1D], INV.Main[2B]), PWM_DAB_D (out, see INV.ControlMCU[1D], INV.ControlMCU[3D], INV.Main[2B]), PWM_HERIC_A (out, see INV.ControlMCU[1D], INV.ControlMCU[3D], INV.Main[4B]), PWM_HERIC_B (out, see INV.ControlMCU[1D], INV.ControlMCU[3D], INV.Main[4B]), PWM_MPPT (in, see INV.ControlMCU[1D], INV.ControlMCU[2D], INV.Main[1D]), PWM_MPPT (out, see INV.ControlMCU[1D], INV.ControlMCU[2D], INV.Main[4D]), PWM_Sine_A (out, see INV.ControlMCU[1D], INV.ControlMCU[3D], INV.Main[3B]), PWM_Sine_B (out, see INV.ControlMCU[1D], INV.ControlMCU[3D], INV.Main[3B]), Relay_1 (out, see INV.ControlMCU[1D], INV.Main[1D], INV.Power[1D], INV.Power[4A]), Relay_2 (out, see INV.ControlMCU[1D], INV.Main[1D], INV.Power[1D], INV.Power[4A]), Relay_3 (out, see INV.ControlMCU[1D], INV.Main[1D], INV.Power[1D], INV.Power[4A]), Relay_4 (out, see INV.ControlMCU[1D], INV.Main[1D], INV.Power[1D], INV.Power[4B]), Relay_5 (out, see INV.ControlMCU[1D], INV.ControlMCU[2D], INV.Main[1D], INV.Power[1D], INV.Power[4B]), Ss_IPV (out, see INV.ControlMCU[1D], INV.Main[1D], INV.Power[1D], INV.Power[2C]), Ss_Trans_1 (out, see INV.ControlMCU[1D], INV.ControlMCU[4D], INV.Main[1D]), Ss_Trans_1 (out, see INV.ControlMCU[1D], INV.ControlMCU[4D], INV.Main[2B]), Ss_Trans_2 (out, see INV.ControlMCU[1D], INV.ControlMCU[4D], INV.Main[1D]), Ss_Trans_2 (out, see INV.ControlMCU[1D], INV.ControlMCU[4D], INV.Main[2B]), Ss_Vout_EVN (out, see INV.ControlMCU[1D], INV.Main[1D], INV.Power[1A], INV.Power[1D]), Ss_Vref_ENV (out, see INV.ControlMCU[1D], INV.Main[1D], INV.Power[1A], INV.Power[1D]), Vout_SsAC (out, see INV.ControlMCU[1D], INV.ControlMCU[5B], INV.Main[4A]), Vout_SsBoost (out, see INV.ControlMCU[1D], INV.ControlMCU[4D], INV.Main[1D]), Vout_SsBoost (out, see INV.ControlMCU[1D], INV.ControlMCU[4D], INV.Main[1D], INV.Main[3A]), Vref_SsAC (out, see INV.ControlMCU[1D], INV.ControlMCU[5B], INV.Main[4A]), Vref_SsBoost (out, see INV.ControlMCU[1D], INV.ControlMCU[4D], INV.Main[1D]), Vref_SsBoost (out, see INV.ControlMCU[1D], INV.ControlMCU[4D], INV.Main[1D], INV.Main[3A])

## Nets
-5V_DR1: C238.2 C239.2 C244.1 C245.1 C246.1 R320.2 T4.16
-5V_DR2: C209.2 C210.2 C215.1 C216.1 C217.1 R314.2 T4.22
-5V_DR3: C134.2 C154.1 C218.2 C219.2 C228.1 C229.1 C230.1 C247.1 C277.2 R315.2 T4.19 U19.4(VEE) U32.4(VEE)
-5V_DR4: C135.1 C136.1 C259.1 C260.1 C261.1 U21.4(VEE)
G_DR1: *24.1(A) C240.2 C241.2 C242.2 C243.2 C244.2 C245.2 C246.2 R320.1
G_DR2: *22.1(A) C211.2 C212.2 C213.2 C214.2 C215.2 C216.2 C217.2 R314.1
G_DR4: *25.1(A) C127.2 C135.2 C146.1 C253.2 C254.2 C255.2 C256.2 C259.2 C260.2 C261.2 L12.2 R185.1 R336.1 V3.3(E) V6.2(C)
G_LLC_A: *30.1(A) C112.1 C113.1 C141.1 C148.2 C149.1 C152.1 C157.2 C158.2 C159.2 C160.2 C302.2 C303.2 C304.2 C305.2 C306.2 C307.2 C308.2 QH2.3(E) QH4.2(C) R231.2 R361.1
G_LLC_B: *28.1(A) C104.1 C105.1 C131.1 C140.2 C142.1 C150.1 C292.2 C293.2 C294.2 C295.2 C297.2 C298.2 C299.2 QH1.3(E) QH3.2(C) R217.2 R360.1 T3.4
GND: FB2.1 J2.5 J2.6 J2.11 J2.12 J2.19 J2.20 J2.29 J2.30 J3.19 R213.2 R221.2 R224.2 R226.2 R240.2 R250.1 R276.2 R277.2 R306.2 R307.2 R348.2
GND_BAT: BT1.8 C161.1 C162.1 C163.1 C164.1 C165.1 C166.1 C167.1 C168.1 C186.1 C188.1 C231.2 C232.2 C233.1 C234.1 C235.2 C257.2 C267.1 C268.1 C269.1 C270.1 C271.1 C272.1 C273.1 C274.1 C275.1 C276.1 C288.2 C289.2 L16.4 P2.3 P2.4 Q16.2(C) Q17.2(C) QL3.3(S) QL4.3(S) R280.2 R281.2 R333.1 R351.2 R353.2 R359.2 T5.8 U22.4(VEE) U23.4(VEE) U29.2(InA-) U29.3(InA+) U29.6(InB-) U29.7(OutPutB) U30.3(+INA) U30.4(GND)
GND_FB: C94.1 C95.1 C96.1 C97.2 C248.2 C249.1 C258.1 CE1.2 FB2.2 J1.35 J1.37 J1.38 J1.45 J1.46 J3.14 NTC1.1 NTC2.1 R334.2 U11.13(Gnd) U31.3
LLC_A_-5V: C109.1 C110.1 C111.1 C149.2 C152.2 C300.2 C301.2 C306.1 C307.1 C308.1 Q13.3(C) R361.2 T4.1 U17.4(VEE)
LLC_B_-5V: C101.1 C102.1 C103.1 C142.2 C150.2 C290.2 C291.2 C297.1 C298.1 C299.1 Q10.3(C) R360.2 T4.7 U12.4(VEE)
LLC_CD_-5V: C175.1 C176.1 C177.1 C180.1 C181.1 C182.1 C202.2 C203.2 C204.2 C205.2 C278.2 C279.2 C285.1 C286.1 C287.1 Q20.3(C) Q21.3(C) R352.2 T4.10 U27.4(VEE) U28.4(VEE)
NEG: *23.1(A) *27.1(A) C100.2 C107.2 C108.2 C144.2 C153.2 C154.2 C178.1 C179.1 C183.1 C184.1 C198.1 C199.1 C200.2 C201.2 C202.1 C203.1 C204.1 C205.1 C208.1 C220.2 C221.2 C222.2 C223.2 C228.2 C229.2 C230.2 C236.2 C237.2 C250.1 C263.1 C264.1 C277.1 C280.2 C281.2 C282.2 C283.2 C285.2 C286.2 C287.2 C296.1 LED1.2 PV_+4.1 QH3.3(E) QH4.3(E) R161.1 R168.2 R180.2 R234.2 R308.2 R309.2 R315.1 R335.2 R344.2 R347.2 R352.1 V6.3(E) V11.3(E) V12.3(E)
VS1: C118.1 C119.1 C120.1 C121.1 C139.1 C224.1 C225.2 Q12.2(C) QL2.3(S) QL3.2(D) R228.2 T3.1 T5.6 U16.4(VEE)
VS2: BT1.6 C114.1 C115.1 C116.1 C117.1 C138.1 C226.2 C227.1 Q11.2(C) QL1.3(S) QL4.2(D) R227.2 T3.2 U15.4(VEE)
+5V: C95.2 C96.2 C249.2 CE1.1 FB1.1 J3.15 J3.16 R323.1 R325.2 U11.14(Vcc) ; port +5V
+5VF: FB1.2 J1.47 J1.48 ; port +5VF
+12V: J1.49 J1.50 J3.17 ; off-sheet +12V
+15V_DAB_A: C118.2 C119.2 C120.2 C121.2 C224.2 C225.1 D33.2(K) R183.1 R184.1 U16.6(VCC) ; off-sheet +15V_DAB_A
+15V_DAB_B: C114.2 C115.2 C116.2 C117.2 C226.1 C227.2 D34.2(K) R181.1 R182.1 U15.6(VCC) ; off-sheet +15V_DAB_B
+15V_DAB_C: C161.2 C162.2 C163.2 C164.2 C231.1 C232.1 C233.2 D36.1(A1) D37.2(K) R245.1 R246.1 R322.2 U22.6(VCC) U30.8(V+) ; off-sheet +15V_DAB_C
+15V_DAB_D: C165.2 C166.2 C167.2 C168.2 C234.2 C235.1 D38.2(K) R247.1 R248.1 U23.6(VCC) ; off-sheet +15V_DAB_D
+15V_DR1: *24.2(K) C238.1 C239.1 C240.1 C241.1 C242.1 C243.1 D39.2(K) ; off-sheet +15V_DR1
+15V_DR2: *22.2(K) C209.1 C210.1 C211.1 C212.1 C213.1 C214.1 D30.2(K) ; off-sheet +15V_DR2
+15V_DR3: *23.2(K) C134.1 C144.1 C218.1 C219.1 C220.1 C221.1 C222.1 C223.1 C247.2 C250.2 D32.2(K) U19.6(VCC) U32.6(VCC) ; off-sheet +15V_DR3
+15V_DR4: *25.2(K) C136.2 C146.2 C251.1 C252.1 C253.1 C254.1 C255.1 C256.1 D40.2(K) U21.6(VCC) ; off-sheet +15V_DR4
+15V_LLC_A: *30.2(K) C109.2 C110.2 C111.2 C112.2 C113.2 C300.1 C301.1 C302.1 C303.1 C304.1 C305.1 D44.2(K) R175.1 R176.1 U17.6(VCC) ; off-sheet +15V_LLC_A
+15V_LLC_B: *28.2(K) C101.2 C102.2 C103.2 C104.2 C105.2 C290.1 C291.1 C292.1 C293.1 C294.1 C295.1 D43.2(K) R169.1 R170.1 U12.6(VCC) ; off-sheet +15V_LLC_B
+15V_LLC_CD: *27.2(K) C175.2 C176.2 C177.2 C178.2 C179.2 C180.2 C181.2 C182.2 C183.2 C184.2 C278.1 C279.1 C280.1 C281.1 C282.1 C283.1 D42.2(K) R266.1 R267.1 R268.1 R269.1 U27.6(VCC) U28.6(VCC) ; off-sheet +15V_LLC_CD
-12V: J1.43 J1.44 J3.13 ; off-sheet -12V
AC_L: J1.8 ; port AC_L
AC_N: J1.7 ; port AC_N
ADC_BAT+: J1.17 R342.1 ; port ADC_BAT+
ADC_BAT-: J1.18 R358.1 ; port ADC_BAT-
ADC_BOOST+: J1.19 R151.1 ; port ADC_BOOST+
ADC_BOOST-: J1.20 R177.1 ; port ADC_BOOST-
ADC_BUS+: J1.3 R158.2 ; port ADC_BUS+
ADC_BUS-: J1.4 R164.2 ; port ADC_BUS-
BAT +48: C267.2 C268.2 C269.2 C270.2 C271.2 C272.2 C273.2 C274.2 C275.2 C276.2 L16.3 P2.1 P2.2 QL1.2(D) QL2.2(D) R317.2 R329.1 R337.2 R351.1 ; off-sheet BAT +48
BUS +: C107.1 C108.1 C236.1 C237.1 D35.3(K) R155.1 R318.1 V3.2(C) ; off-sheet BUS +, port 400VDC Cấp cho Heric
Ctr_Fan1: J1.41 J3.22 ; port Ctr_Fan1
Ctr_Fan2: J1.42 J3.24 ; port Ctr_Fan2
CTR_Relay: J2.4 J3.18 ; port CTR_Relay
EVN_L: J1.31 J3.7 ; port EVN_L
EVN_N: J1.32 J3.8 ; port EVN_N
Fan_Ss: J1.39 J3.12 ; port Fan_Ss
Heric_L: J1.27 ; port Heric_L
Heric_N: J1.28 ; port Heric_N
J1-6: C248.1 J1.6 R323.2 U31.4 ; port J1-6
J1-15: J1.13 J1.15 L14.3 R249.1 R257.1 ; port Ss_Trans_1, port J1-15
J1-16: J1.14 J1.16 L14.4 R249.2 R257.2 ; port Ss_Trans_2, port J1-16
J1-22: J1.22 J3.3 ; port J1-22
J1-34: C258.2 J1.34 R325.1 R334.1 ; port J1-34
L_Out: J1.30 J3.5 ; port L_Out
N_Out: J1.29 J3.6 ; port N_Out
NTC1: J1.25 NTC1.2 ; port NTC1
NTC2: J1.40 NTC2.2 ; port NTC2
PE_Bus+: J1.21 J3.4 ; port PE_Bus+
PV+: J1.23 J3.10 ; port PV+
PV-: J1.24 J3.9 ; port PV-
PWM_BOOST_A: J2.9 R225.1 ; port PWM_BOOST_A
PWM_BOOST_B: J2.10 R252.2 ; port PWM_BOOST_B
PWM_DAB_A: J2.22 R196.2 R260.2 ; port PWM_DAB_A
PWM_DAB_B: J2.21 R193.2 R258.2 ; port PWM_DAB_B
PWM_DAB_C: J2.24 R186.1 R284.1 ; port PWM_DAB_C
PWM_DAB_D: J2.23 R191.1 R283.1 ; port PWM_DAB_D
PWM_HERIC_A: J2.27 ; port PWM_HERIC_A
PWM_HERIC_B: J2.26 ; port PWM_HERIC_B
PWM_MPPT: J2.8 R330.1 ; port PWM_MPPT
PWM_Sine_A: J2.25 ; port PWM_Sine_A
PWM_Sine_B: J2.28 ; port PWM_Sine_B
Relay_1: J2.16 J3.26 ; port Relay_1
Relay_2: J2.15 J3.27 ; port Relay_2
Relay_3: J2.2 J3.28 ; port Relay_3
Relay_4: J2.13 J3.25 ; port Relay_4
Relay_5: J2.14 J3.23 ; port Relay_5
Ss_IPV: J1.26 J3.11 ; port Ss_IPV
Ss_Vout_EVN: J1.1 J3.1 ; port Ss_Vout_EVN
Ss_Vref_ENV: J1.2 J3.2 ; port Ss_Vref_ENV
Vout_SsAC: J1.36 ; port Vout_SsAC
Vout_SsBoost: J1.11 J1.12 R150.2 ; port Vout_SsBoost
Vref_SsAC: J1.33 ; port Vref_SsAC
Vref_SsBoost: J1.9 J1.10 R149.2 ; port Vref_SsBoost
Net2_1: 2.1 C262.2 C265.2 C266.2 L16.2
Net3_1: 3.1 C265.1 C266.1 C284.1 L16.1
Net*21_1: *21.1 C208.2
Net*26_1: *26.1 C262.1 C284.2
Net*29_1: *29.1 C288.1 C289.1
NetBT1_1: BT1.1 J6.1 T4.4 T5.1
NetBT1_2: BT1.2 BT1.3
NetBT1_4: BT1.4 D31.2(K)
NetBT1_5: BT1.5 D34.1(A)
NetBT1_7: BT1.7 D38.1(A)
NetC94_2: C94.2 R150.1 U11.12(Vout)
NetC97_1: C97.1 R149.1 U11.11(Vfef)
NetC100_1: C100.1 QH1.2(C) QH2.2(C) R154.2 R165.1 U11.1(In)
NetC127_1: C127.1 R199.1
NetC128_1: C128.1 R195.2 R213.1 U12.3(CATHODE)
NetC128_2: C128.2 R186.2 R195.1 U12.1(ANODE)
NetC129_1: C129.1 R206.2 R221.1 U15.3(CATHODE)
NetC129_2: C129.2 R193.1 R206.1 U15.1(ANODE)
NetC130_1: C130.1 R207.2 R224.1 U16.3(CATHODE)
NetC130_2: C130.2 R196.1 R207.1 U16.1(ANODE)
NetC131_2: C131.2 Q6.1(B) Q10.1(B) R189.2
NetC132_1: C132.1 R211.2 R226.1 U17.3(CATHODE)
NetC132_2: C132.2 R191.2 R211.1 U17.1(ANODE)
NetC138_2: C138.2 Q7.1(B) Q11.1(B) R194.1
NetC139_2: C139.2 Q8.1(B) Q12.1(B) R197.1
NetC140_1: C140.1 R209.2
NetC141_2: C141.2 Q9.1(B) Q13.1(B)
NetC148_1: C148.1 R222.2
NetC153_1: C153.1 R233.1
NetC157_1: C157.1 C158.1 C159.1 C160.1 T3.3
NetC170_1: C170.1 R262.2 R276.1 U22.3(CATHODE)
NetC170_2: C170.2 R258.1 R262.1 U22.1(ANODE)
NetC172_1: C172.1 R263.2 R277.1 U23.3(CATHODE)
NetC172_2: C172.2 R260.1 R263.1 U23.1(ANODE)
NetC186_2: C186.2 Q15.1(B) Q17.1(B) R261.1
NetC188_2: C188.2 Q14.1(B) Q16.1(B) R259.1
NetC193_1: C193.1 R296.2 R306.1 U27.3(CATHODE)
NetC193_2: C193.2 R283.2 R296.1 U27.1(ANODE)
NetC194_1: C194.1 R297.2 R307.1 U28.3(CATHODE)
NetC194_2: C194.2 R284.2 R297.1 U28.1(ANODE)
NetC198_2: C198.2 Q18.1(B) Q20.1(B) R293.2
NetC199_2: C199.2 Q19.1(B) Q21.1(B) R294.2
NetC200_1: C200.1 R302.2
NetC201_1: C201.1 R304.2
NetC251_2: C251.2 C252.2 R336.2 T4.13
NetC257_1: C257.1 R326.1 R327.2 R333.2
NetC263_2: C263.2 R343.1
NetC264_2: C264.2 R346.2
NetC296_2: C296.2 R359.1
NetD28_1: D28.1(A) D29.1(A1) D29.3(A2) D31.1(A) J6.2
NetD28_2: D28.2(K) T5.4
NetD29_2: D29.2(K) T4.5
NetD30_1: D30.1(A) T4.21
NetD32_1: D32.1(A) T4.18
NetD33_1: D33.1(A) T5.5
NetD35_1: D35.1(A1) D35.2(A2) L15.2 V11.2(C) V12.2(C)
NetD36_2: D36.2(A2) R317.1
NetD36_3: D36.3(K) R316.1
NetD37_1: D37.1(A) T5.7
NetD39_1: D39.1(A) T4.15
NetD40_1: D40.1(A) T4.12
NetD41_1: D41.1(A1) D41.2(A2) R350.1
NetD41_3: D41.3(K) U30.7(OUTB) U31.2
NetD42_1: D42.1(A) T4.11
NetD43_1: D43.1(A) T4.8
NetD44_1: D44.1(A) T4.2
NetL12_1: L12.1 U11.2(Out)
NetL15_1: L15.1 PV_+3.1
NetLED1_1: LED1.1 R324.2 R335.1
NetQ6_2: Q6.2(E) Q10.2(E) R198.1 R209.1 R210.1
NetQ6_3: Q6.3(C) R169.2 R170.2
NetQ7_2: Q7.2(C) R181.2 R182.2
NetQ7_3: Q7.3(E) Q11.3(E) R208.2 R219.2
NetQ8_2: Q8.2(C) R183.2 R184.2
NetQ8_3: Q8.3(E) Q12.3(E) R212.2 R220.2
NetQ9_2: Q9.2(E) Q13.2(E) R214.1 R222.1 R223.1
NetQ9_3: Q9.3(C) R175.2 R176.2
NetQ14_2: Q14.2(C) R245.2 R246.2
NetQ14_3: Q14.3(E) Q16.3(E) R264.2 R272.2
NetQ15_2: Q15.2(C) R247.2 R248.2
NetQ15_3: Q15.3(E) Q17.3(E) R265.2 R273.2
NetQ18_2: Q18.2(E) Q20.2(E) R300.1 R302.1 R303.1
NetQ18_3: Q18.3(C) R266.2 R267.2
NetQ19_2: Q19.2(E) Q21.2(E) R301.1 R304.1 R305.1
NetQ19_3: Q19.3(C) R268.2 R269.2
NetQH1_1: QH1.1(G) R198.2 R210.2 R217.1
NetQH2_1: QH2.1(G) R214.2 R223.2 R231.1
NetQH3_1: QH3.1(G) R300.2 R303.2 R308.1
NetQH4_1: QH4.1(G) R301.2 R305.2 R309.1
NetQL1_1: QL1.1(G) R208.1 R219.1 R227.1
NetQL2_1: QL2.1(G) R212.1 R220.1 R228.1
NetQL3_1: QL3.1(G) R264.1 R272.1 R280.1
NetQL4_1: QL4.1(G) R265.1 R273.1 R281.1
NetR151_2: R151.2 R152.1
NetR152_2: R152.2 R153.1
NetR153_2: R153.2 R154.1
NetR155_2: R155.2 R156.1
NetR156_2: R156.2 R157.1
NetR157_2: R157.2 R158.1
NetR161_2: R161.2 R162.1
NetR162_2: R162.2 R163.1
NetR163_2: R163.2 R164.1
NetR165_2: R165.2 R166.1
NetR166_2: R166.2 R167.1
NetR167_2: R167.2 R168.1
NetR177_2: R177.2 R178.1
NetR178_2: R178.2 R179.1
NetR179_2: R179.2 R180.1
NetR185_2: R185.2 R199.2 R215.2 V3.1(G)
NetR189_1: R189.1 U12.5(VOUT)
NetR194_2: R194.2 U15.5(VOUT)
NetR197_2: R197.2 U16.5(VOUT)
NetR215_1: R215.1 U21.5(VOUT)
NetR225_2: R225.2 R232.1 U19.1(ANODE)
NetR230_1: R230.1 U19.5(VOUT)
NetR230_2: R230.2 R233.2 R234.1 V6.1(G)
NetR232_2: R232.2 R240.1 U19.3(CATHODE)
NetR250_2: R250.2 R251.1 U21.3(CATHODE)
NetR251_2: R251.2 R252.1 U21.1(ANODE)
NetR259_2: R259.2 U22.5(VOUT)
NetR261_2: R261.2 U23.5(VOUT)
NetR293_1: R293.1 U27.5(VOUT)
NetR294_1: R294.1 U28.5(VOUT)
NetR316_2: R316.2 R349.2 U29.1(OutPutA) U29.8(Vcc)
NetR318_2: R318.2 R319.1
NetR319_2: R319.2 R321.1
NetR321_2: R321.2 R324.1
NetR322_1: R322.1 U31.1
NetR326_2: R326.2 U30.6(-INB)
NetR327_1: R327.1 R328.2
NetR328_1: R328.1 R329.2
NetR330_2: R330.2 R345.1 U32.1(ANODE)
NetR331_1: R331.1 R332.1 U32.5(VOUT)
NetR331_2: R331.2 R343.2 R344.1 V11.1(G)
NetR332_2: R332.2 R346.1 R347.1 V12.1(G)
NetR337_1: R337.1 R338.2
NetR338_1: R338.1 R339.2
NetR339_1: R339.1 R340.2
NetR340_1: R340.1 R341.2
NetR341_1: R341.1 R342.2
NetR345_2: R345.2 R348.1 U32.3(CATHODE)
NetR349_1: R349.1 R350.2 U30.5(+INB)
NetR353_1: R353.1 R354.2
NetR354_1: R354.1 R355.2
NetR355_1: R355.1 R356.2
NetR356_1: R356.1 R357.2
NetR357_1: R357.1 R358.2
NetT5_2: T5.2 T5.3
NetU30_1: U30.1(OUTA) U30.2(-INA)

Not connected (* = marked no-connect by the designer): J1 5*; J2 1* 3* 7 17* 18*; J3 20* 21* 29* 30*; L14 1 2; U17 5(VOUT); U29 4(VEE/Gnd) 5(InB+)

## Layout directives
mark named ?: NetR316_2, NetU29_4, NetU29_5
mark named Check: NetJ2_7

## Notes on the sheet
- Title:
- NOTE:
- Size:
- Date:
- Uplate:
- Number:
- Time:
- Revision:
- (in symbol LM358N/NOPB) A; B

## Library data of the parts
2 3 *21 *26 *29 PV_+3 PV_+4 = Copper
BT1 T5 = Tranfomer EE13: Designed by: VanDungEvn; Value: BAX
C94-C97 C101-C105 C109-C121 C127-C132 C134-C136 C138 C139 C141 C142 C144 C146 C148-C150 C152-C154 C161-C168 C170 C172 C175-C184 C186 C188 C193 C194 C198 C199 C202-C205 C224 C227 C232-C234 C247-C250 C257 C258 C263 C264 C277 = CAP-SMD: Value: 33pF
C100 = CAP C3D 35x46x35mm: capacitor E256238; MP: ECWFG2J475KA; MF: Panasonic; Value: *; Price: None; Package: MOLDED-2 Panasonic; Availability: In Stock; Check_prices: https://www.snapeda.com/parts/ECWFG2J475KA/Panasonic/view-part/?ref=eda; SnapEDA_Link: https://www.snapeda.com/parts/ECWFG2J475KA/Panasonic/view-part/?ref=snap
C107 C108 C225 C226 C231 C235-C237 = Cap - 10x18 - N: Cắm; Don_Vi: Con; So_Chan: 2; Ten_Linh_Kien: Tụ Hóa 220uF 10V 6x11MM; Ma_Hang: MH004510; Chung_Loai: Cắm; Kieu_Chan: *
C140 C200 C201 C209 C211-C218 C220-C223 C228-C230 C238 C240-C246 C251 C253-C256 C259-C261 C278 C280-C283 C285-C287 C290 C292-C295 C297-C300 C302-C308 = Tu dan gom: Tu khong phan cuc; Value: 0.47uF
C157-C160 = ECWFG2J475KA: Metallized Polypropylene Film Capacitor; MF: Panasonic; Value: *; Price: None; Package: MOLDED-2 Panasonic; MP: ECWFG2J475KA; Availability: In Stock; Check_prices: https://www.snapeda.com/parts/ECWFG2J475KA/Panasonic/view-part/?ref=eda; SnapEDA_Link: https://www.snapeda.com/parts/ECWFG2J475KA/Panasonic/view-part/?ref=snap
C208 = Cap an toan: Metallized Polypropylene Film Capacitor; MP: ECWFG2J475KA; MF: Panasonic; Value: *; Price: None; Package: MOLDED-2 Panasonic; Availability: In Stock; Check_prices: https://www.snapeda.com/parts/ECWFG2J475KA/Panasonic/view-part/?ref=eda; SnapEDA_Link: https://www.snapeda.com/parts/ECWFG2J475KA/Panasonic/view-part/?ref=snap
C210 C219 C239 C252 C279 C291 C301 = Cap - 10x18 - N: Cắm 100uF 25V; Don_Vi: Con; So_Chan: 2; Ten_Linh_Kien: Tụ Hóa 220uF 10V 6x11MM; Ma_Hang: MH004510; Chung_Loai: Cắm; Kieu_Chan: *
C262 C284 C288 C289 = CC0603JRNPO9BN910: CAP CER 91PF 50V 5% COG/NPO 0603; Solder: SMT; CompanyID: VT-01341; Value: 91pF/50V; MPN: CC0603JRNPO9BN910; Category: CAPACITOR; PinCount: 2
C265-C276 = CC0603JRNPO9BN910: Cap Film; Solder: SMT; CompanyID: VT-01341; Value: 91pF/50V; MPN: CC0603JRNPO9BN910; Category: CAPACITOR; PinCount: 2
C296 = CAP N5-1n/500V: Metallized Polypropylene Film Capacitor; MP: ECWFG2J475KA; MF: Panasonic; Value: *; Price: None; Package: MOLDED-2 Panasonic; Availability: In Stock; Check_prices: https://www.snapeda.com/parts/ECWFG2J475KA/Panasonic/view-part/?ref=eda; SnapEDA_Link: https://www.snapeda.com/parts/ECWFG2J475KA/Panasonic/view-part/?ref=snap
CE1 = CAP-ALU-DIP: 6x14mm; Published: 8-Jun-2000; LatestRevisionDate: 17-Jul-2002; LatestRevisionNote: Re-released for DXP Platform.; PackageReference: POLAR0.8; Publisher: Altium Limited
D28 D30-D34 D37-D40 D42-D44 = DIODE: Diode 600V 2A thay the ES2J; Value: 1N4007
D29 = Diode Double: 200V/5A TO-252 MURD520; MP: STTH2003CG-TR; Package: None; Price: None; Value: *; Availability: Unavailable
D35 = Diode Double: 600V/30A STTH30AC06 TO3P-3L; MP: STTH2003CG-TR; Package: None; Price: None; Value: *; Availability: Unavailable
D36 = Diode Double: MP: STTH2003CG-TR; Package: None; Price: None; Value: *; Availability: Unavailable
D41 = Diode Double: STTH2003 Series Dual 10 A 1 V 35 ns Secondary Rectifier Surface Mount - D2PAK; MP: STTH2003CG-TR; Package: None; Price: None; Value: *; Availability: Unavailable
FB1 FB2 = RC0603FR-0775RL: RES SMD 75 OHM 1% 1/10W 0603; Solder: SMT; Value: 75R; MPN: RC0603FR-0775RL; Category: RESISTOR; PinCount: 2
J1 = Header 25x2: Header, 25x2-Pin 2.5mm; LatestRevisionDate: 17-Jul-2002; LatestRevisionNote: Re-released for DXP Platform.; Publisher: Altium Limited
J2 J3 = Header 15x2: Header, 15x2-Pin 2.5mm; LatestRevisionDate: 17-Jul-2002; LatestRevisionNote: Re-released for DXP Platform.; Publisher: Altium Limited
J6 NTC1 NTC2 = Jump2
L12 = LBOSHOG-V1: Cuận cảm bộ sạc PWM Hybrid; Value: Loc 220; Designed by: VanDungEvn
L14 = Bien ap dong: Biến áp đo dòng; Value: Loc 220; Designed by: VanDungEvn
L15 = LBOSPVOG-V1: Cuận cảm bộ sạc PWM Hybrid; Value: Loc 220; Designed by: VanDungEvn
L16 = LBATOG-V1: Cuận cảm bộ sạc PWM Hybrid; Value: Loc 220; Designed by: VanDungEvn
LED1 = LED1-SMD: Value: LED 3 - 5 ly 2 Colour
P2 = Header 4P 2.54 Duc Thang: Cắm; Ten_Linh_Kien: Header 4P XH2.54-4P Đực Thẳng; Don_Vi: Con; Ma_Hang: MH001285; Chung_Loai: Cắm
Q6 Q9 Q18 Q19 = D882M: NPN 40V/2A PBSS4240T
Q7 Q8 Q14 Q15 = D882M: thay the D882
Q10 Q13 Q20 Q21 = B772M-PNP: PNP 40V/2A PBSS5240T; Value: C9015
Q11 Q12 Q16 Q17 = B772M-PNP: thay the B772; Value: C9015
QH1-QH4 = FGA25N120ANTD: IGBT NPT IKW50N65EH5 thay the xang IKW50N65ET7; MF: ON Semiconductor; Value: *; Digi-Key_Purchase_URL: https://www.digikey.in/product-detail/en/on-semiconductor/FGA25N120ANTDTU/FGA25N120ANTDTU-ND/820640?utm_source=snapeda&utm_medium=aggregator&utm_campaign=symbol; MP: FGA25N120ANTD; Package: TO-3 Fairchild Semiconductor; SnapEDA_Link: https://www.snapeda.com/parts/FGA25N120ANTD/ON%20Semiconductor/view-part/202622/?ref=snap; Digi-Key_Part_Number: FGA25N120ANTDTU-ND
QL1-QL4 = MOSFET IRF N: N-channel mosfet IRFP4468PBF; Value: IRF840
R149 R150 R169 R170 R175 R176 R181-R186 R189 R191 R193-R199 R206-R215 R217 R219-R228 R230-R234 R240 R245-R248 R250-R252 R258-R269 R272 R273 R276 R277 R280 R281 R283 R284 R293 R294 R296 R297 R300-R309 R316 R322 R323 R325-R334 R343-R350 = Res-SMD: 0805; Manufacturer: Generic Components; Class: Passive; Published: 08/06/2000; Publisher: Altium Hobart Technology Centre
R151-R158 R161-R168 R177-R180 = Res-SMD: 1206; Manufacturer: Generic Components; Class: Passive; Published: 08/06/2000; Publisher: Altium Hobart Technology Centre
R249 R257 R314 R315 R320 R336-R342 R351-R361 = R dan: Resistor 0805; Manufacturer: Generic Components; Class: Passive; Published: 08/06/2000; Publisher: Altium Hobart Technology Centre
R317-R319 R321 R324 R335 = Res-SMD: 1210 EX; Manufacturer: Generic Components; Class: Passive; Published: 08/06/2000; Publisher: Altium Hobart Technology Centre
T3 = Transfomer PM62: Biến áp xung 5KW PM62/44; MP: 14A-10R-10; Package: None; Price: None; Value: *; Availability: Unavailable
T4 = Transfomer EE28: MP: 14A-10R-10; Package: None; Price: None; Value: *; Availability: Unavailable
U11 = Current sensor: Bien dong sinomags STB-CAS/R; Value: Loc 220; Designed by: VanDungEvn
U12 U15-U17 U19 U21-U23 U27 U28 U32 = ACPL-W346-000E: 2.5A Gate Driver Optical Coupling 5000Vrms 1 Channel 6-SO Stretched; MF: Broadcom Limited; Package: SOIC-6 Broadcom; Availability: Unavailable; MP: ACPL-W346-000E; Value: *; SnapEDA_Link: https://www.snapeda.com/parts/ACPL-W346-000E/Broadcom%20Limited/view-part/2767622/?ref=snap; Price: None
U29 = LM358 SOP8: Dán; Ma_Hang: MH000609; Don_Vi: Con; Ten_Linh_Kien: LM358 SOP8; Kieu_Chan: *; Ghi_Chu: *; Chung_Loai: Dán
U30 = LM358N/NOPB: MF: Texas Instruments; SnapEDA_Link: https://www.snapeda.com/parts/LM358N/NOPB/Texas+Instruments/view-part/?ref=snap; Package: PDIP-8 Texas; MP: LM358N/NOPB; Check_prices: https://www.snapeda.com/parts/LM358N/NOPB/Texas+Instruments/view-part/?ref=eda; Purchase-URL: https://pricing.snapeda.com/search/part/LM358N/NOPB/?ref=eda; Price: None; Value: *; Availability: In Stock
U31 = VOM617A-2T: OPTOISOLATOR 3.75KV TRANS 4-SOP; Solder: SMT; CompanyID: VT-xxxx; MPN: VOM617A-2T; Value: VOM617A-2T
V3 V6 V11 V12 = FGA25N120ANTD: IGBT NPT G40H65DFB ST; MF: ON Semiconductor; Value: *; Digi-Key_Purchase_URL: https://www.digikey.in/product-detail/en/on-semiconductor/FGA25N120ANTDTU/FGA25N120ANTDTU-ND/820640?utm_source=snapeda&utm_medium=aggregator&utm_campaign=symbol; MP: FGA25N120ANTD; Package: TO-3 Fairchild Semiconductor; SnapEDA_Link: https://www.snapeda.com/parts/FGA25N120ANTD/ON%20Semiconductor/view-part/202622/?ref=snap; Digi-Key_Part_Number: FGA25N120ANTDTU-ND